# EAGLE schematic Sensor Acquisition Board Rev5 (EAGLE 9.6.2)

## Sheet 1 of 5: Connectors
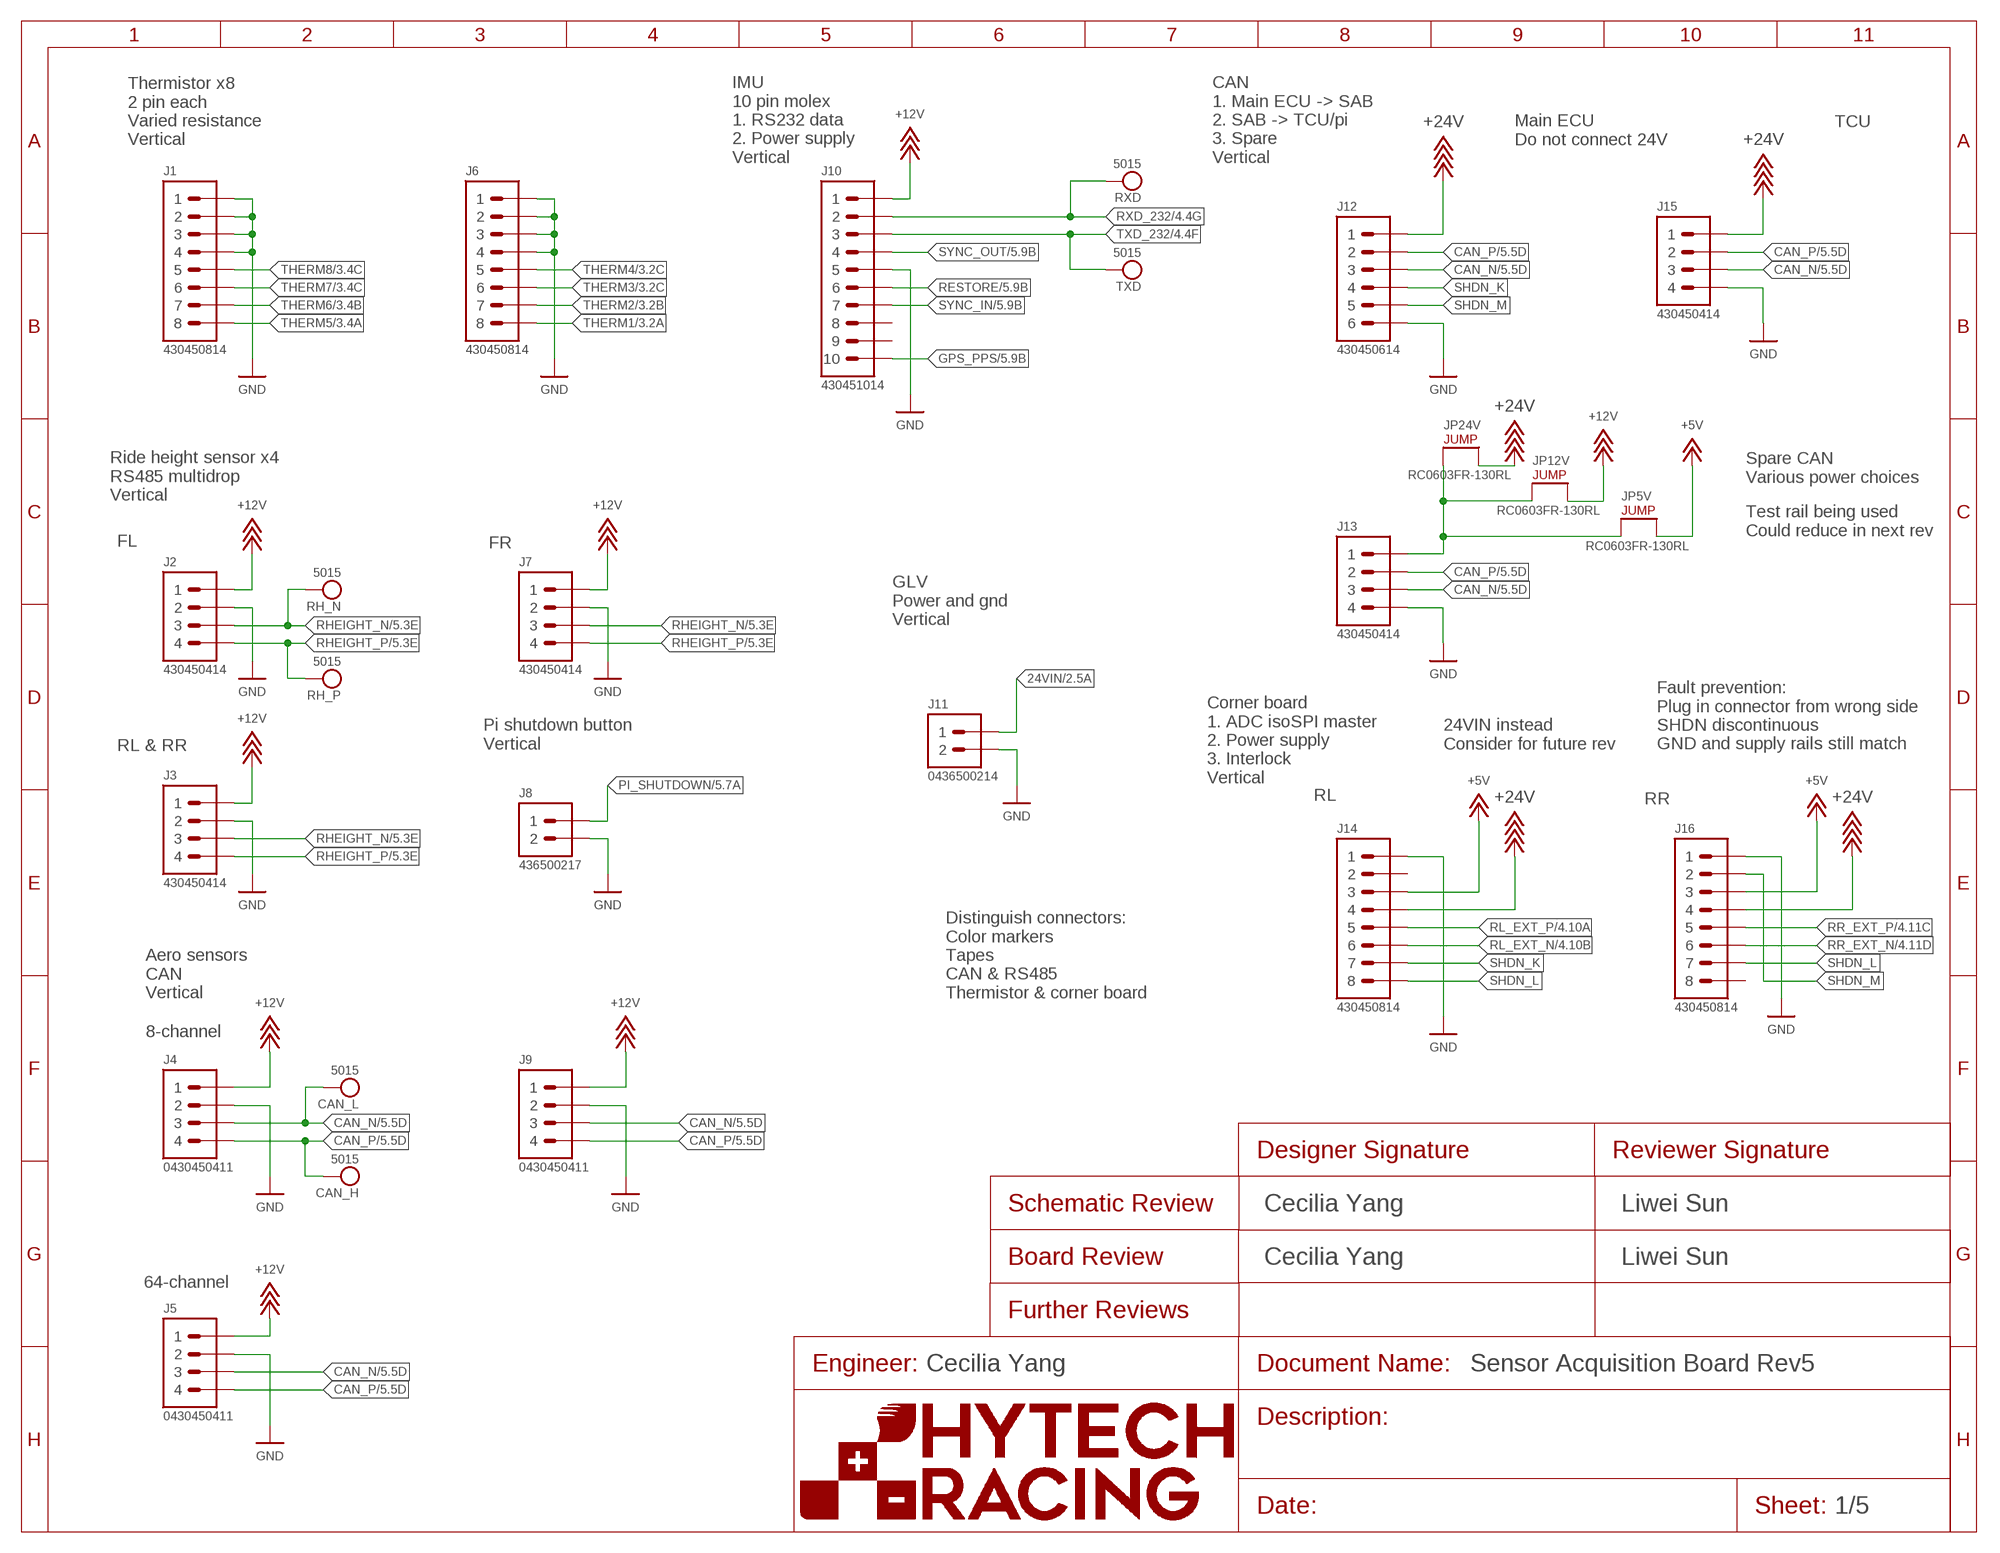
[diagram p0: schematic, sheet 1]

### Parts
CAN_H  TEST_POINT  [5015]
CAN_L  TEST_POINT  [5015]
J1  CONNECTOR-8_μF_T_V_BLACK  [MOLEX_MICROFIT_PTH_VERTICAL_08_DUAL]
J2  CONNECTOR-4_μF_T_V_BLACK  [MOLEX_MICROFIT_PTH_VERTICAL_04_DUAL]
J3  CONNECTOR-4_μF_T_V_BLACK  [MOLEX_MICROFIT_PTH_VERTICAL_04_DUAL]
J4  CONNECTOR-4_μF_S_RA_  [MOLEX_MICROFIT_SMD_RIGHTANGLE_04_DUAL]
J5  CONNECTOR-4_μF_S_RA_  [MOLEX_MICROFIT_SMD_RIGHTANGLE_04_DUAL]
J6  CONNECTOR-8_μF_T_V_BLACK  [MOLEX_MICROFIT_PTH_VERTICAL_08_DUAL]
J7  CONNECTOR-4_μF_T_V_BLACK  [MOLEX_MICROFIT_PTH_VERTICAL_04_DUAL]
J8  CONNECTOR-2_μF_T_V_BLACK  [MOLEX_MICROFIT_PTH_VERTICAL_02_DUAL]
J9  CONNECTOR-4_μF_S_RA_  [MOLEX_MICROFIT_SMD_RIGHTANGLE_04_DUAL]
J10  CONNECTOR-10_MF_T_V_  [MOLEX_MICROFIT_PTH_VERTICAL_10_DUAL]
J11  CONNECTOR-2_MICROFIT_SMD_RIGHTANGLE_02_SINGLE_BLACK  [MOLEX_MICROFIT_SMD_RIGHTANGLE_02_SINGLE]
J12  CONNECTOR-6_μF_T_V_BLACK  [MOLEX_MICROFIT_PTH_VERTICAL_06_DUAL]
J13  CONNECTOR-4_μF_T_V_BLACK  [MOLEX_MICROFIT_PTH_VERTICAL_04_DUAL]
J14  CONNECTOR-8_μF_T_V_BLACK  [MOLEX_MICROFIT_PTH_VERTICAL_08_DUAL]
J15  CONNECTOR-4_μF_T_V_BLACK  [MOLEX_MICROFIT_PTH_VERTICAL_04_DUAL]
J16  CONNECTOR-8_μF_T_V_BLACK  [MOLEX_MICROFIT_PTH_VERTICAL_08_DUAL]
JP5V  JUMPER_0603_  [0603-RES]
JP12V  JUMPER_0603_  [0603-RES]
JP24V  JUMPER_0603_  [0603-RES]
RH_N  TEST_POINT  [5015]
RH_P  TEST_POINT  [5015]
RXD  TEST_POINT  [5015]
TXD  TEST_POINT  [5015]

### Nets
24VIN: J11.1 ; also sheet 2
+5V: J14.3 J16.3 JP5V.2 ; also sheet 2,5
+12V: J2.1 J3.1 J4.1 J5.1 J7.1 J9.1 J10.1 JP12V.2 ; also sheet 2
+24V: J12.1 J14.4 J15.1 J16.4 JP24V.2 ; also sheet 2
CAN_N: CAN_L.1 J4.3 J5.3 J9.3 J12.3 J13.3 J15.3 ; also sheet 5
CAN_P: CAN_H.1 J4.4 J5.4 J9.4 J12.2 J13.2 J15.2 ; also sheet 5
GND: J1.1 J1.2 J1.3 J1.4 J2.2 J3.2 J4.2 J5.2 J6.1 J6.2 J6.3 J6.4 J7.2 J8.2 J9.2 J10.5 J11.2 J12.6 J13.4 J14.1 J15.4 J16.1 ; also sheet 2,3,4,5
GPS_PPS: J10.10 ; also sheet 5
N$5: J13.1 JP5V.1 JP12V.1 JP24V.1
PI_SHUTDOWN: J8.1 ; also sheet 5
RESTORE: J10.6 ; also sheet 5
RHEIGHT_N: J2.3 J3.3 J7.3 RH_N.1 ; also sheet 5
RHEIGHT_P: J2.4 J3.4 J7.4 RH_P.1 ; also sheet 5
RL_EXT_N: J14.6 ; also sheet 4
RL_EXT_P: J14.5 ; also sheet 4
RR_EXT_N: J16.6 ; also sheet 4
RR_EXT_P: J16.5 ; also sheet 4
RXD_232: J10.2 RXD.1 ; also sheet 4
SHDN_K: J12.4 J14.7
SHDN_L: J14.8 J16.7
SHDN_M: J12.5 J16.2
SYNC_IN: J10.7 ; also sheet 5
SYNC_OUT: J10.4 ; also sheet 5
THERM1: J6.8 ; also sheet 3,5
THERM2: J6.7 ; also sheet 3,5
THERM3: J6.6 ; also sheet 3,5
THERM4: J6.5 ; also sheet 3,5
THERM5: J1.8 ; also sheet 3,5
THERM6: J1.7 ; also sheet 3,5
THERM7: J1.6 ; also sheet 3,5
THERM8: J1.5 ; also sheet 3,5
TXD_232: J10.3 TXD.1 ; also sheet 4
Unconnected: J10.8 J10.9 J14.2 J16.8

### Notes on the sheet
- TCU
- Thermistor x8
  2 pin each
  Varied resistance
  Vertical
- Main ECU
  Do not connect 24V
- IMU
  10 pin molex
  1. RS232 data
  2. Power supply
  Vertical
- CAN
  1. Main ECU -> SAB
  2. SAB -> TCU/pi
  3. Spare
  Vertical
- Spare CAN
  Various power choices
- Ride height sensor x4
  RS485 multidrop
  Vertical
- Test rail being used
  Could reduce in next rev
- FL | FR
- GLV
  Power and gnd
  Vertical
- Pi shutdown button
  Vertical
- 24VIN instead
  Consider for future rev
- Fault prevention:
  Plug in connector from wrong side
  SHDN discontinuous
  GND and supply rails still match
- RL & RR
- Corner board
  1. ADC isoSPI master
  2. Power supply
  3. Interlock
  Vertical
- RL | RR
- Aero sensors
  CAN
  Vertical
- Distinguish connectors:
  Color markers
  Tapes
  CAN & RS485
  Thermistor & corner board
- 8-channel
- Cecilia Yang | Liwei Sun
- Cecilia Yang | Liwei Sun
- 64-channel
- Cecilia Yang

## Sheet 2 of 5: Power supplies
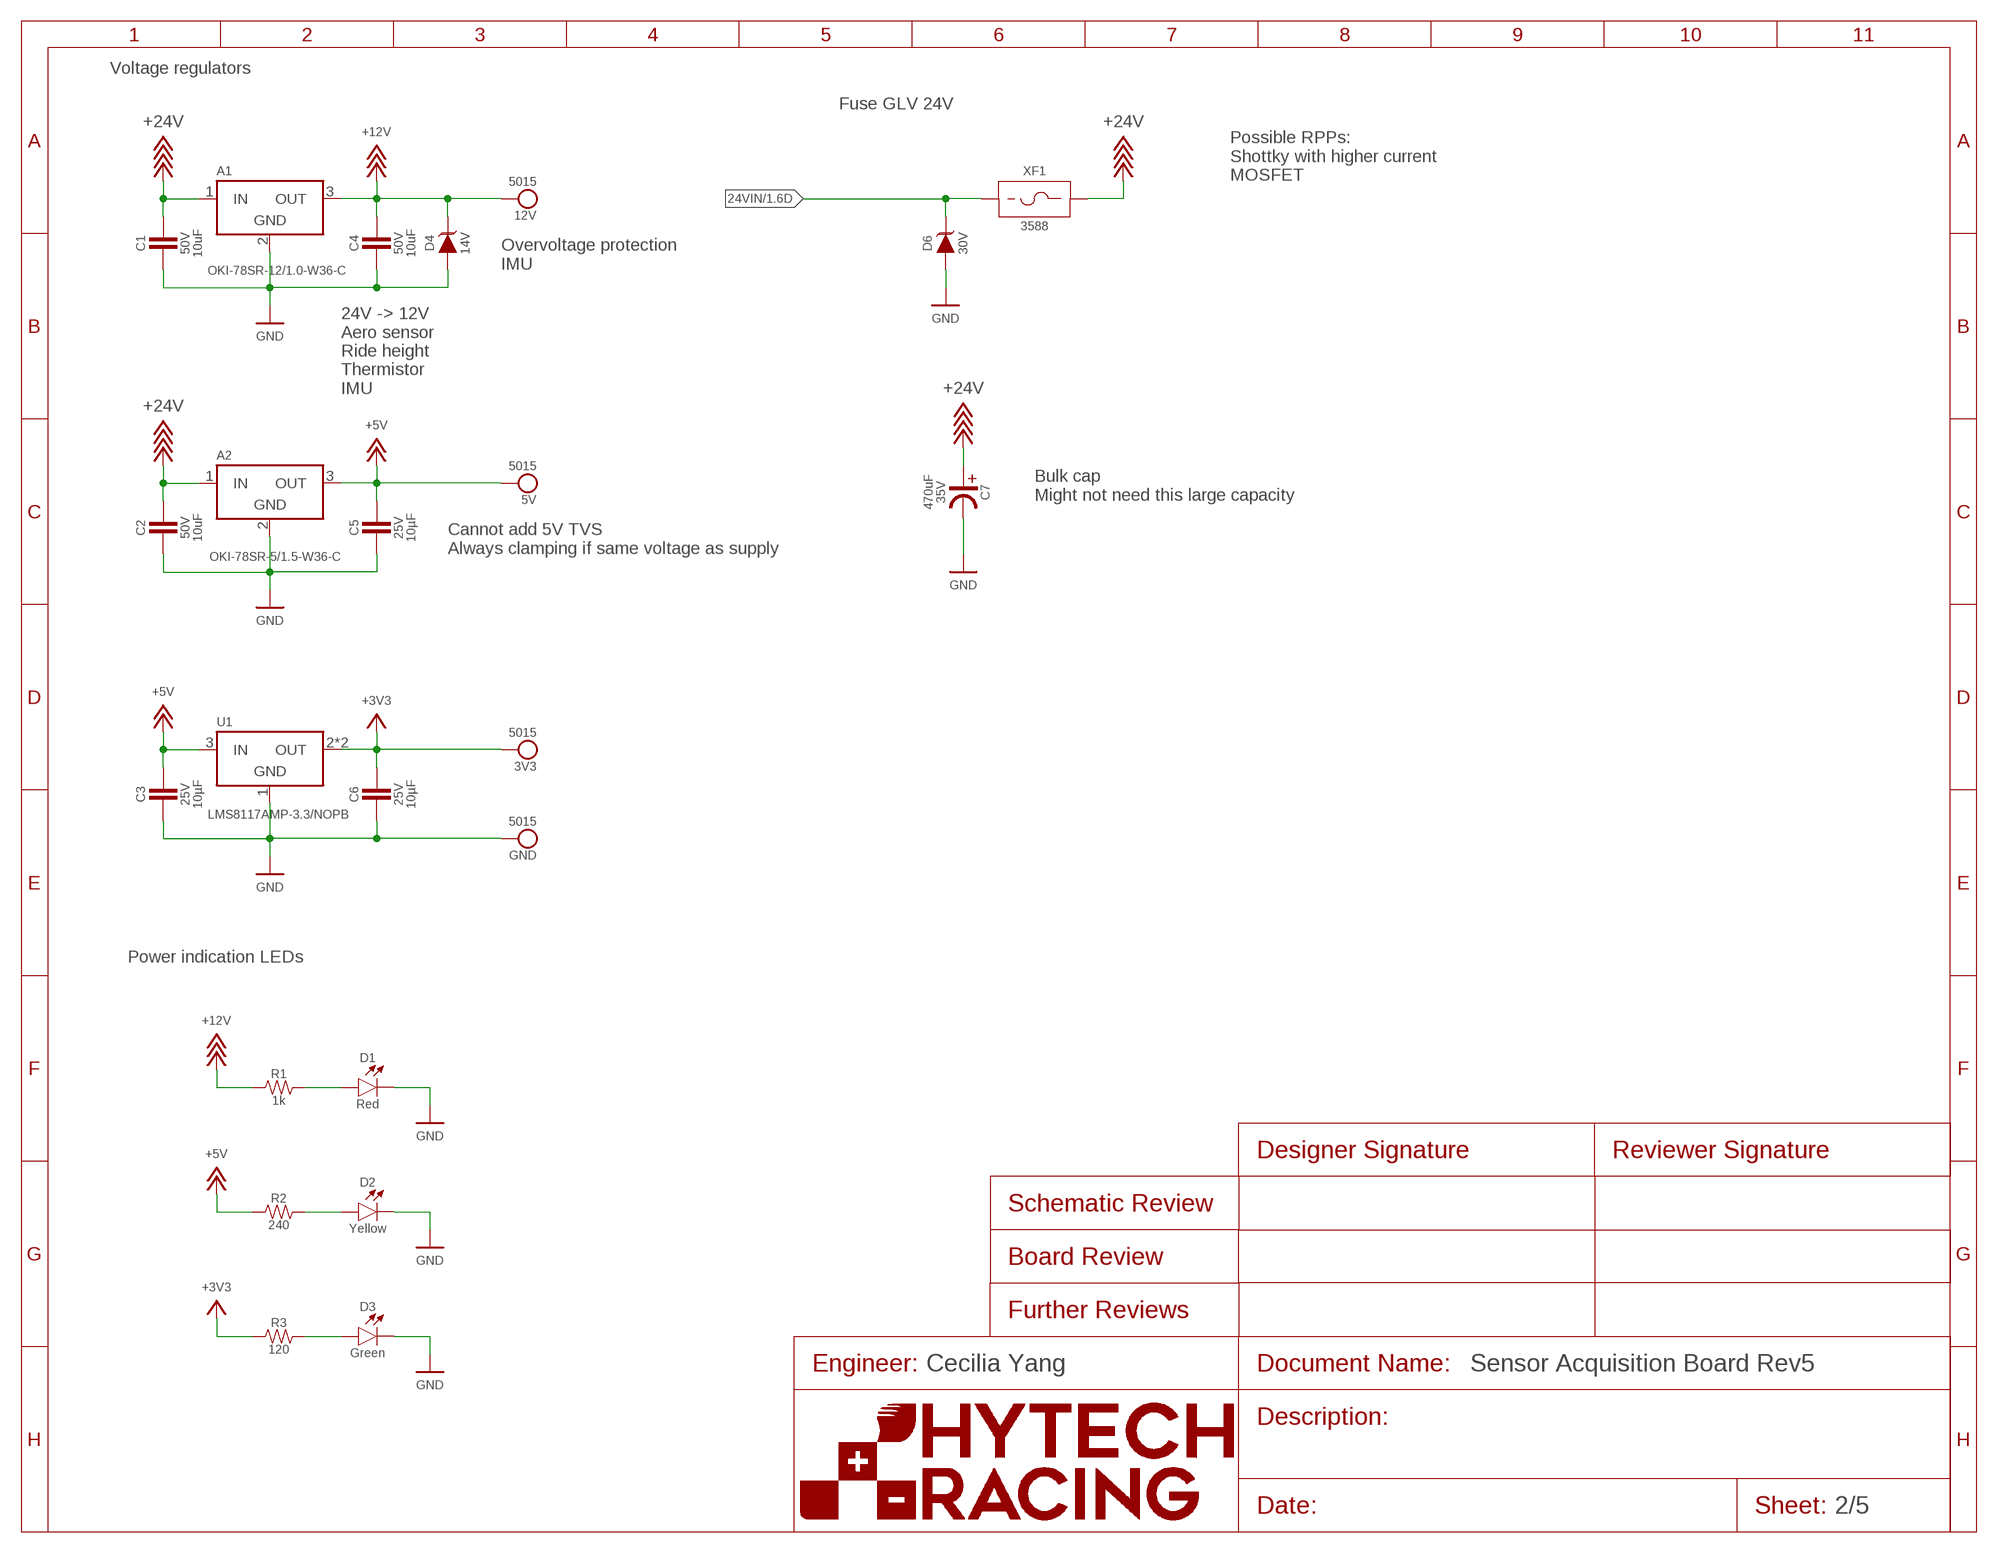
[diagram p1: schematic, sheet 2]

### Parts
3V3  TEST_POINT  [5015]
5V  TEST_POINT  [5015]
12V  TEST_POINT  [5015]
A1  VOLTAGE_REGULATOR_MODULE_OKI-78SR_12V  [OKI-78SR]
A2  VOLTAGE_REGULATOR_MODULE_OKI-78SR_5V  [OKI-78SR]
C1  CAPACITOR_0805_50V_10UF  [0805-CAP]
C2  CAPACITOR_0805_50V_10UF  [0805-CAP]
C3  CAPACITOR_0603_25V_10UF  [0603-CAP]
C4  CAPACITOR_0805_50V_10UF  [0805-CAP]
C5  CAPACITOR_0603_25V_10UF  [0603-CAP]
C6  CAPACITOR_0603_25V_10UF  [0603-CAP]
C7  CAPACITOR_ELECTROLYTIC_EEH_AZS_470UF  [EEH-AZS]
D1  LED_0603_RED  [0603-LED]
D2  LED_0603_YELLOW  [0603-LED]
D3  LED_0603_GREEN  [0603-LED]
D4  TVS_DO-219AB_14V  [SMF]
D6  TVS_DO-214AA_30V  [1.5SMBJ]
GND  TEST_POINT  [5015]
R1  RESISTOR_0603_1K  [0603-RES]
R2  RESISTOR_0603_240  [0603-RES]
R3  RESISTOR_0603_120  [0603-RES]
U1  VOLTAGE_REGULATOR_SOT-223_3.3V  [SOT-223]
XF1  FUSE_HOLDER_MINIBLADESMD  [3588]

### Nets
24VIN: D6.2(C) XF1.1 XF1.2 ; also sheet 1
+3V3: 3V3.1 C6.1 R3.1 U1.2(OUT) U1.4(OUT) ; also sheet 3,4,5
+5V: 5V.1 A2.3(OUT) C3.1 C5.1 R2.1 U1.3(IN) ; also sheet 1,5
+12V: 12V.1 A1.3(OUT) C4.1 D4.P$2(C) R1.1 ; also sheet 1
+24V: A1.1(IN) A2.1(IN) C1.1 C2.1 C7.PLUS XF1.3 XF1.4 ; also sheet 1
GND: A1.2(GND) A2.2(GND) C1.2 C2.2 C3.2 C4.2 C5.2 C6.2 C7.MINUS D1.1(C) D2.1(C) D3.1(C) D4.P$1(A) D6.1(A) GND.1 U1.1(GND) ; also sheet 1,3,4,5
N$23: D1.2(A) R1.2
N$29: D2.2(A) R2.2
N$32: D3.2(A) R3.2

### Notes on the sheet
- Voltage regulators
- Fuse GLV 24V
- Possible RPPs:
  Shottky with higher current
  MOSFET
- Overvoltage protection
  IMU
- 24V -> 12V
  Aero sensor
  Ride height
  Thermistor
  IMU
- Bulk cap
  Might not need this large capacity
- Cannot add 5V TVS
  Always clamping if same voltage as supply
- Power indication LEDs
- Cecilia Yang

## Sheet 3 of 5: Filters
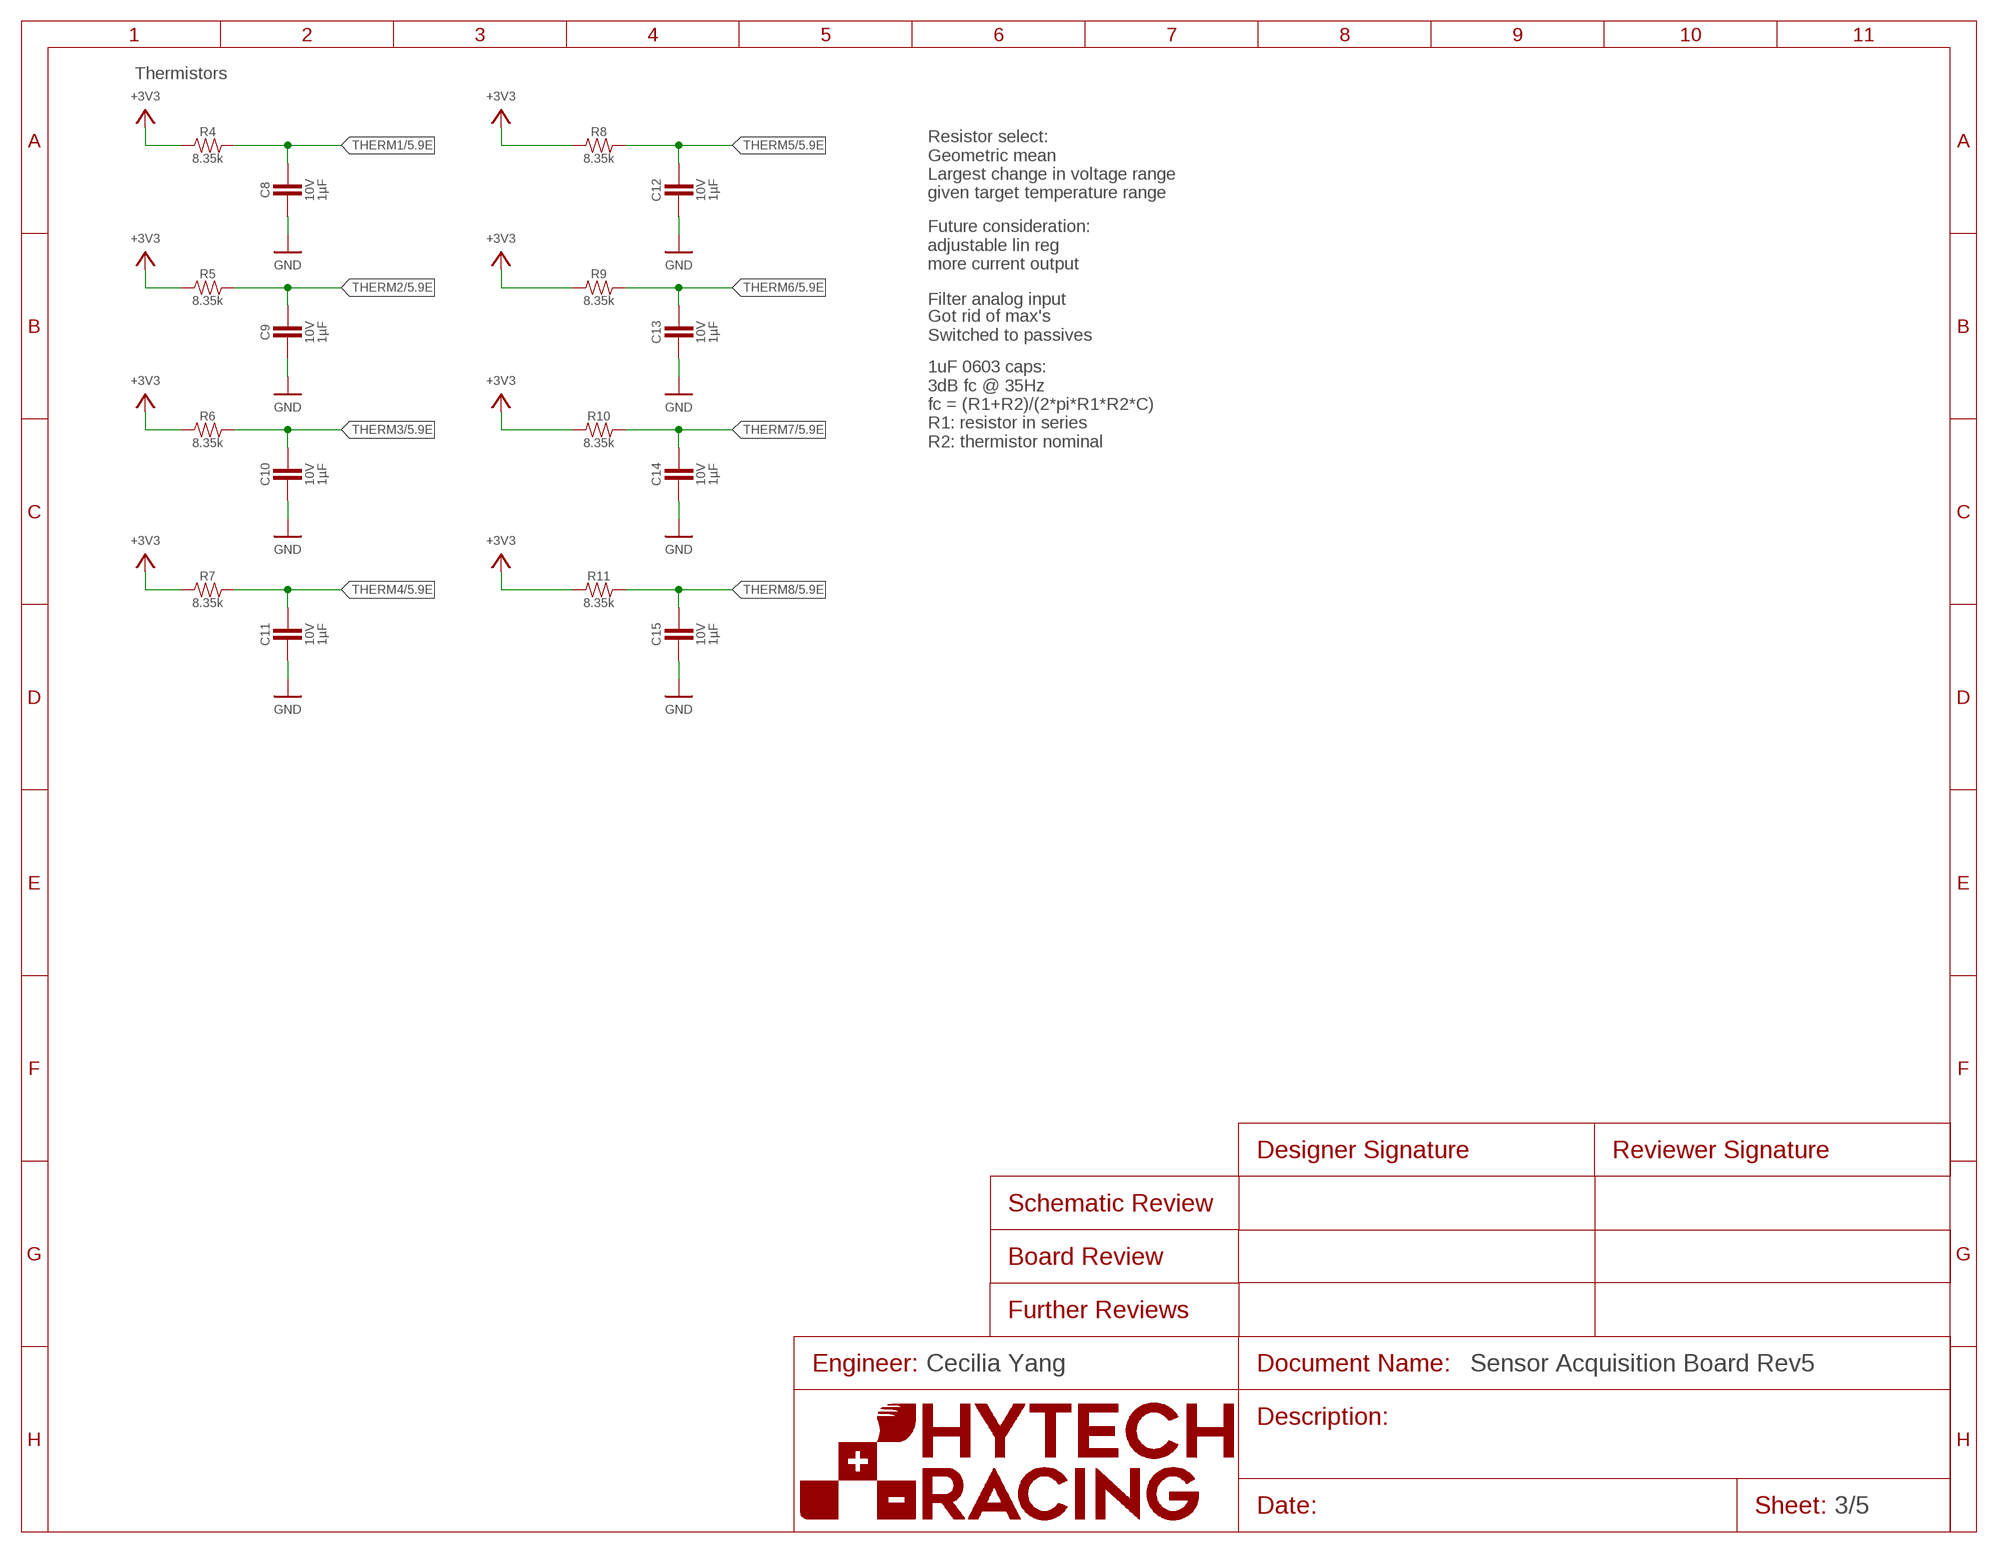
[diagram p2: schematic, sheet 3]

### Parts
C8  CAPACITOR_0603_10V_1UF  [0603-CAP]
C9  CAPACITOR_0603_10V_1UF  [0603-CAP]
C10  CAPACITOR_0603_10V_1UF  [0603-CAP]
C11  CAPACITOR_0603_10V_1UF  [0603-CAP]
C12  CAPACITOR_0603_10V_1UF  [0603-CAP]
C13  CAPACITOR_0603_10V_1UF  [0603-CAP]
C14  CAPACITOR_0603_10V_1UF  [0603-CAP]
C15  CAPACITOR_0603_10V_1UF  [0603-CAP]
R4  RESISTOR_0603_8.35K  [0603-RES]
R5  RESISTOR_0603_8.35K  [0603-RES]
R6  RESISTOR_0603_8.35K  [0603-RES]
R7  RESISTOR_0603_8.35K  [0603-RES]
R8  RESISTOR_0603_8.35K  [0603-RES]
R9  RESISTOR_0603_8.35K  [0603-RES]
R10  RESISTOR_0603_8.35K  [0603-RES]
R11  RESISTOR_0603_8.35K  [0603-RES]

### Nets
+3V3: R4.1 R5.1 R6.1 R7.1 R8.1 R9.1 R10.1 R11.1 ; also sheet 2,4,5
GND: C8.2 C9.2 C10.2 C11.2 C12.2 C13.2 C14.2 C15.2 ; also sheet 1,2,4,5
THERM1: C8.1 R4.2 ; also sheet 1,5
THERM2: C9.1 R5.2 ; also sheet 1,5
THERM3: C10.1 R6.2 ; also sheet 1,5
THERM4: C11.1 R7.2 ; also sheet 1,5
THERM5: C12.1 R8.2 ; also sheet 1,5
THERM6: C13.1 R9.2 ; also sheet 1,5
THERM7: C14.1 R10.2 ; also sheet 1,5
THERM8: C15.1 R11.2 ; also sheet 1,5

### Notes on the sheet
- Thermistors
- Resistor select:
  Geometric mean
  Largest change in voltage range
  given target temperature range
- Future consideration:
  adjustable lin reg
  more current output
- Filter analog input
- Got rid of max's
  Switched to passives
- 1uF 0603 caps:
  3dB fc @ 35Hz
  fc = (R1+R2)/(2*pi*R1*R2*C)
  R1: resistor in series
  R2: thermistor nominal
- Cecilia Yang

## Sheet 4 of 5: isoSPI and RS232
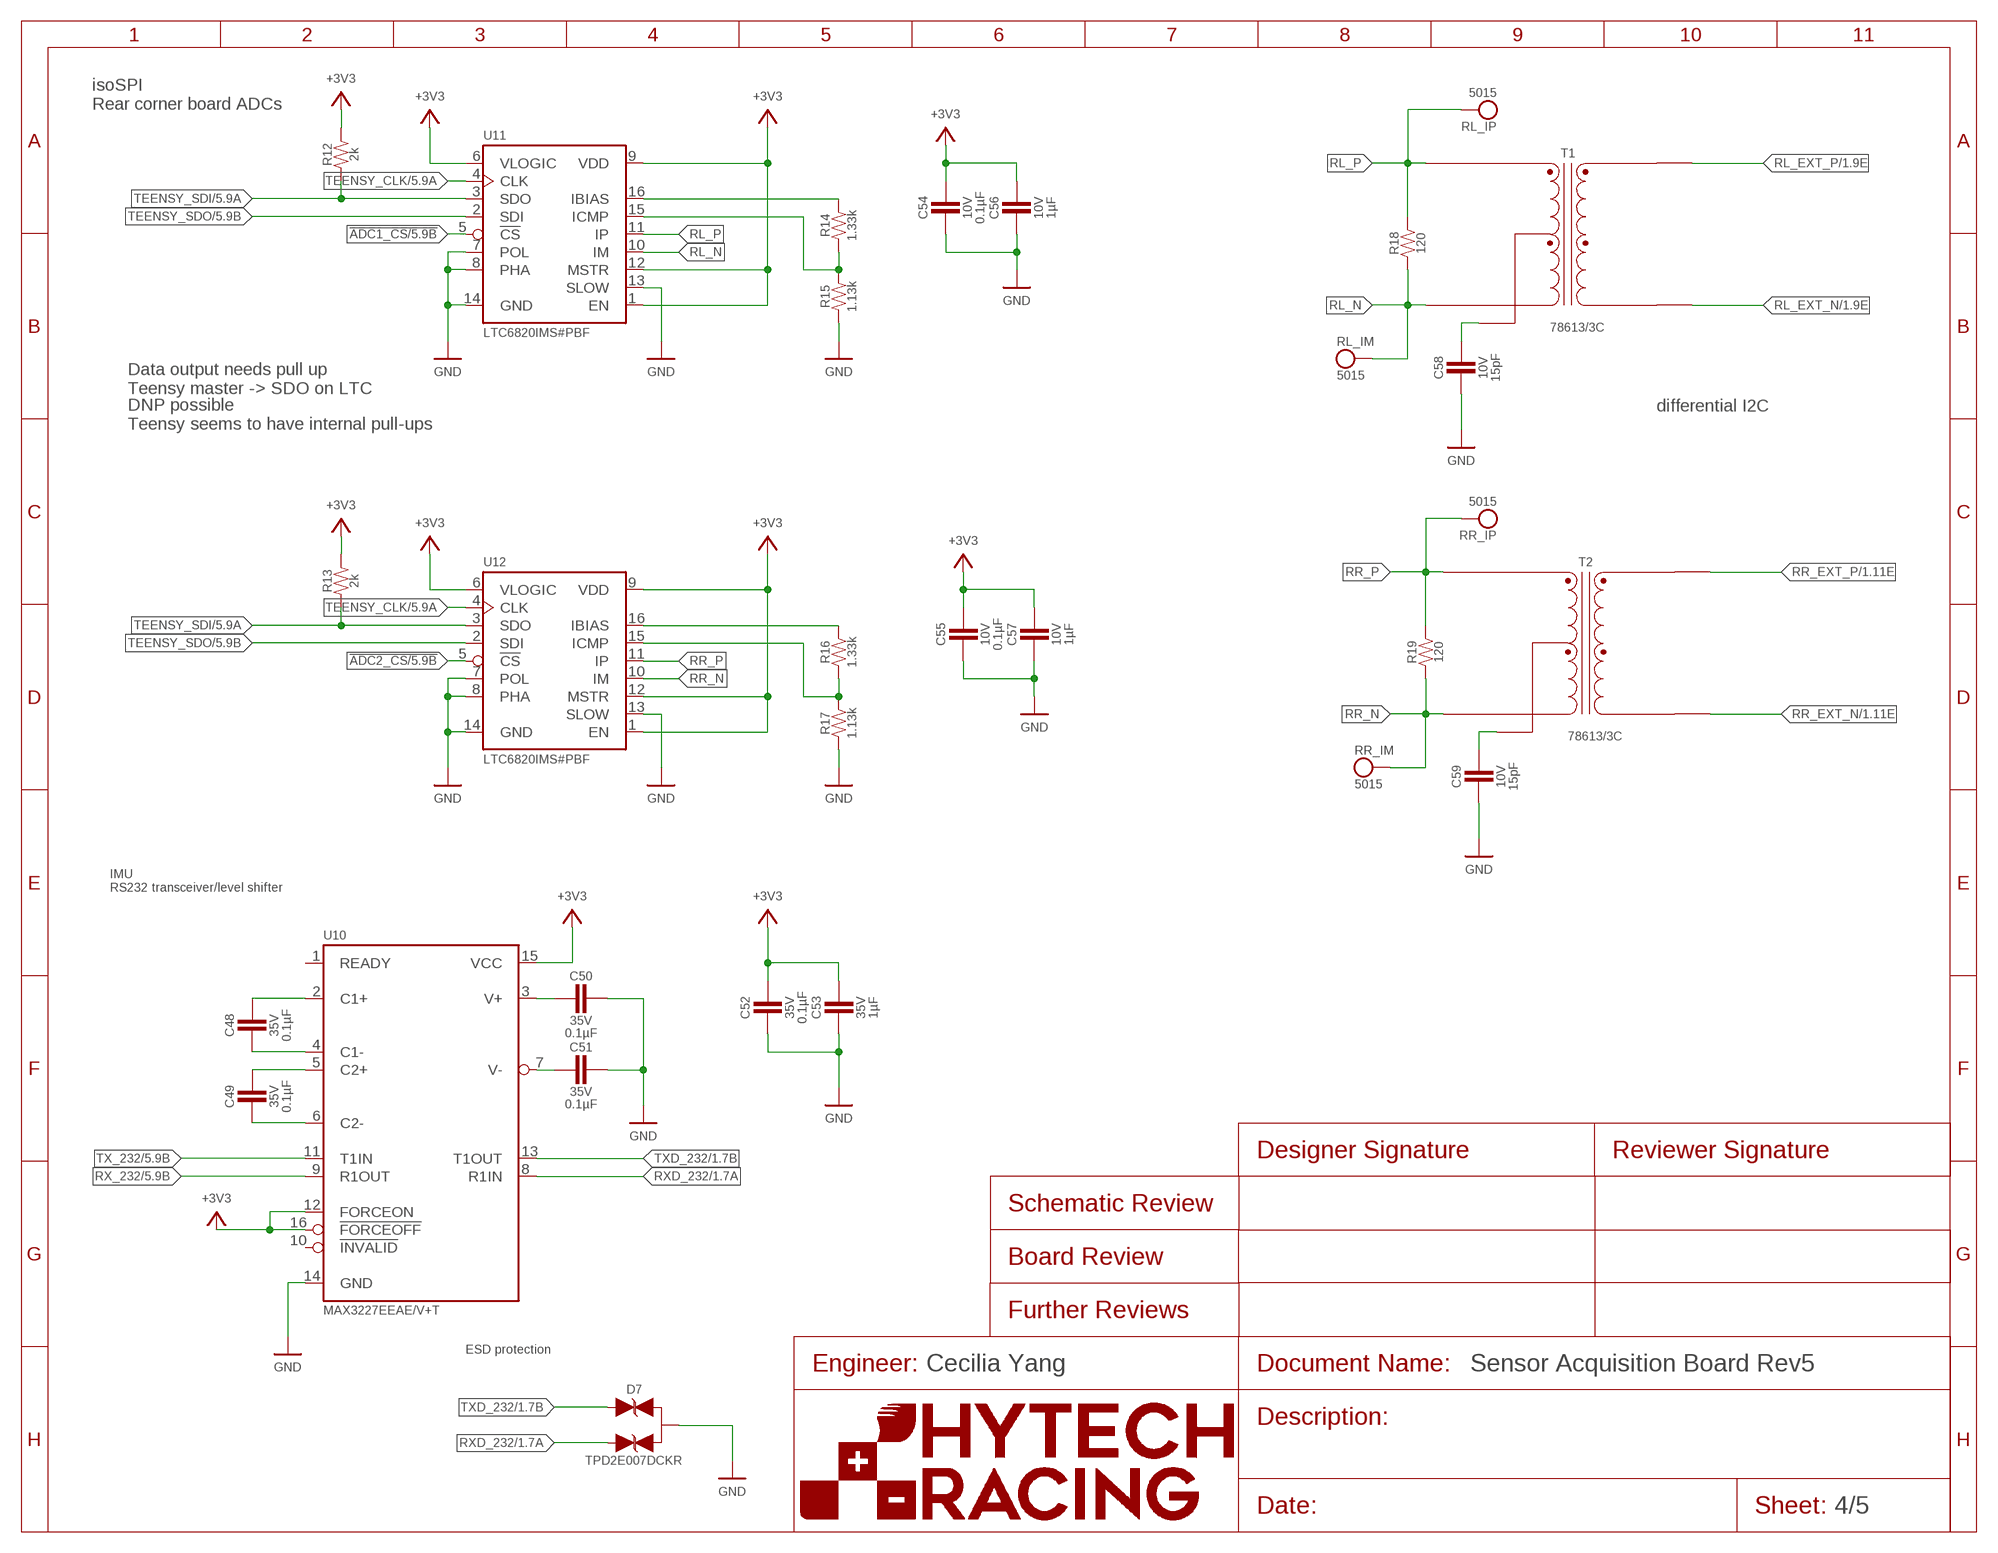
[diagram p3: schematic, sheet 4]

### Parts
C48  CAPACITOR_0603_35V_0.1UF  [0603-CAP]
C49  CAPACITOR_0603_35V_0.1UF  [0603-CAP]
C50  CAPACITOR_0603_35V_0.1UF  [0603-CAP]
C51  CAPACITOR_0603_35V_0.1UF  [0603-CAP]
C52  CAPACITOR_0603_35V_0.1UF  [0603-CAP]
C53  CAPACITOR_0603_35V_1UF  [0603-CAP]
C54  CAPACITOR_0603_10V_0.1UF  [0603-CAP]
C55  CAPACITOR_0603_10V_0.1UF  [0603-CAP]
C56  CAPACITOR_0603_10V_1UF  [0603-CAP]
C57  CAPACITOR_0603_10V_1UF  [0603-CAP]
C58  CAPACITOR_0603_10V_15PF  [0603-CAP]
C59  CAPACITOR_0603_10V_15PF  [0603-CAP]
D7  TVS_BIDIRECTIONAL_DUAL  [SC-70-3]
R12  RESISTOR_0603_2K  [0603-RES]
R13  RESISTOR_0603_2K  [0603-RES]
R14  RESISTOR_0603_1.33K  [0603-RES]
R15  RESISTOR_0603_1.13K  [0603-RES]
R16  RESISTOR_0603_1.33K  [0603-RES]
R17  RESISTOR_0603_1.13K  [0603-RES]
R18  RESISTOR_0603_120  [0603-RES]
R19  RESISTOR_0603_120  [0603-RES]
RL_IM  TEST_POINT  [5015]
RL_IP  TEST_POINT  [5015]
RR_IM  TEST_POINT  [5015]
RR_IP  TEST_POINT  [5015]
T1  78613/3C_78613/3C  [78613/3C]
T2  78613/3C_78613/3C  [78613/3C]
U10  MAX3227  [SSOP-16]
U11  LTC6820  [MSOP-16]
U12  LTC6820  [MSOP-16]

### Nets
!ADC1_CS: U11.5(!CS) ; also sheet 5
!ADC2_CS: U12.5(!CS) ; also sheet 5
+3V3: C52.1 C53.1 C54.1 C55.1 C56.1 C57.1 R12.2 R13.2 U10.12(FORCEON) U10.15(VCC) U10.16(!FORCEOFF) U11.1(EN) U11.6(VLOGIC) U11.9(VDD) U11.12(MSTR) U12.1(EN) U12.6(VLOGIC) U12.9(VDD) U12.12(MSTR) ; also sheet 2,3,5
GND: C50.1 C51.1 C52.2 C53.2 C54.2 C55.2 C56.2 C57.2 C58.2 C59.2 D7.3(A) R15.1 R17.1 U10.14(GND) U11.7(POL) U11.8(PHA) U11.13(SLOW) U11.14(GND) U12.7(POL) U12.8(PHA) U12.13(SLOW) U12.14(GND) ; also sheet 1,2,3,5
N$1: C50.2 U10.3(V+)
N$2: C48.1 U10.2(C1+)
N$3: C51.2 U10.7(V-)
N$16: R16.2 U12.16(IBIAS)
N$17: R16.1 R17.2 U12.15(ICMP)
N$18: R14.2 U11.16(IBIAS)
N$19: R14.1 R15.2 U11.15(ICMP)
N$21: C58.1 T1.2(PRI_CENTER_TAP)
N$22: C59.1 T2.2(PRI_CENTER_TAP)
N$24: C48.2 U10.4(C1-)
N$25: C49.1 U10.5(C2+)
N$26: C49.2 U10.6(C2-)
RL_EXT_N: T1.4(SEC_1) ; also sheet 1
RL_EXT_P: T1.6(SEC_2) ; also sheet 1
RL_N: R18.1 RL_IM.1 T1.3(PRI_2) U11.10(IM)
RL_P: R18.2 RL_IP.1 T1.1(PRI_1) U11.11(IP)
RR_EXT_N: T2.4(SEC_1) ; also sheet 1
RR_EXT_P: T2.6(SEC_2) ; also sheet 1
RR_N: R19.1 RR_IM.1 T2.3(PRI_2) U12.10(IM)
RR_P: R19.2 RR_IP.1 T2.1(PRI_1) U12.11(IP)
RX_232: U10.9(R1OUT) ; also sheet 5
RXD_232: D7.2(C2) U10.8(R1IN) ; also sheet 1
TEENSY_CLK: U11.4(CLK) U12.4(CLK) ; also sheet 5
TEENSY_SDI: R12.1 R13.1 U11.3(SDO) U12.3(SDO) ; also sheet 5
TEENSY_SDO: U11.2(SDI) U12.2(SDI) ; also sheet 5
TX_232: U10.11(T1IN) ; also sheet 5
TXD_232: D7.1(C1) U10.13(T1OUT) ; also sheet 1
Unconnected: U10.1(READY) U10.10(!INVALID)

### Notes on the sheet
- isoSPI
  Rear corner board ADCs
- Data output needs pull up
  Teensy master -> SDO on LTC
- differential I2C
- DNP possible
  Teensy seems to have internal pull-ups
- IMU
  RS232 transceiver/level shifter
- ESD protection
- Cecilia Yang

## Sheet 5 of 5: CAN, RS485, ADC, Teensy 4.0
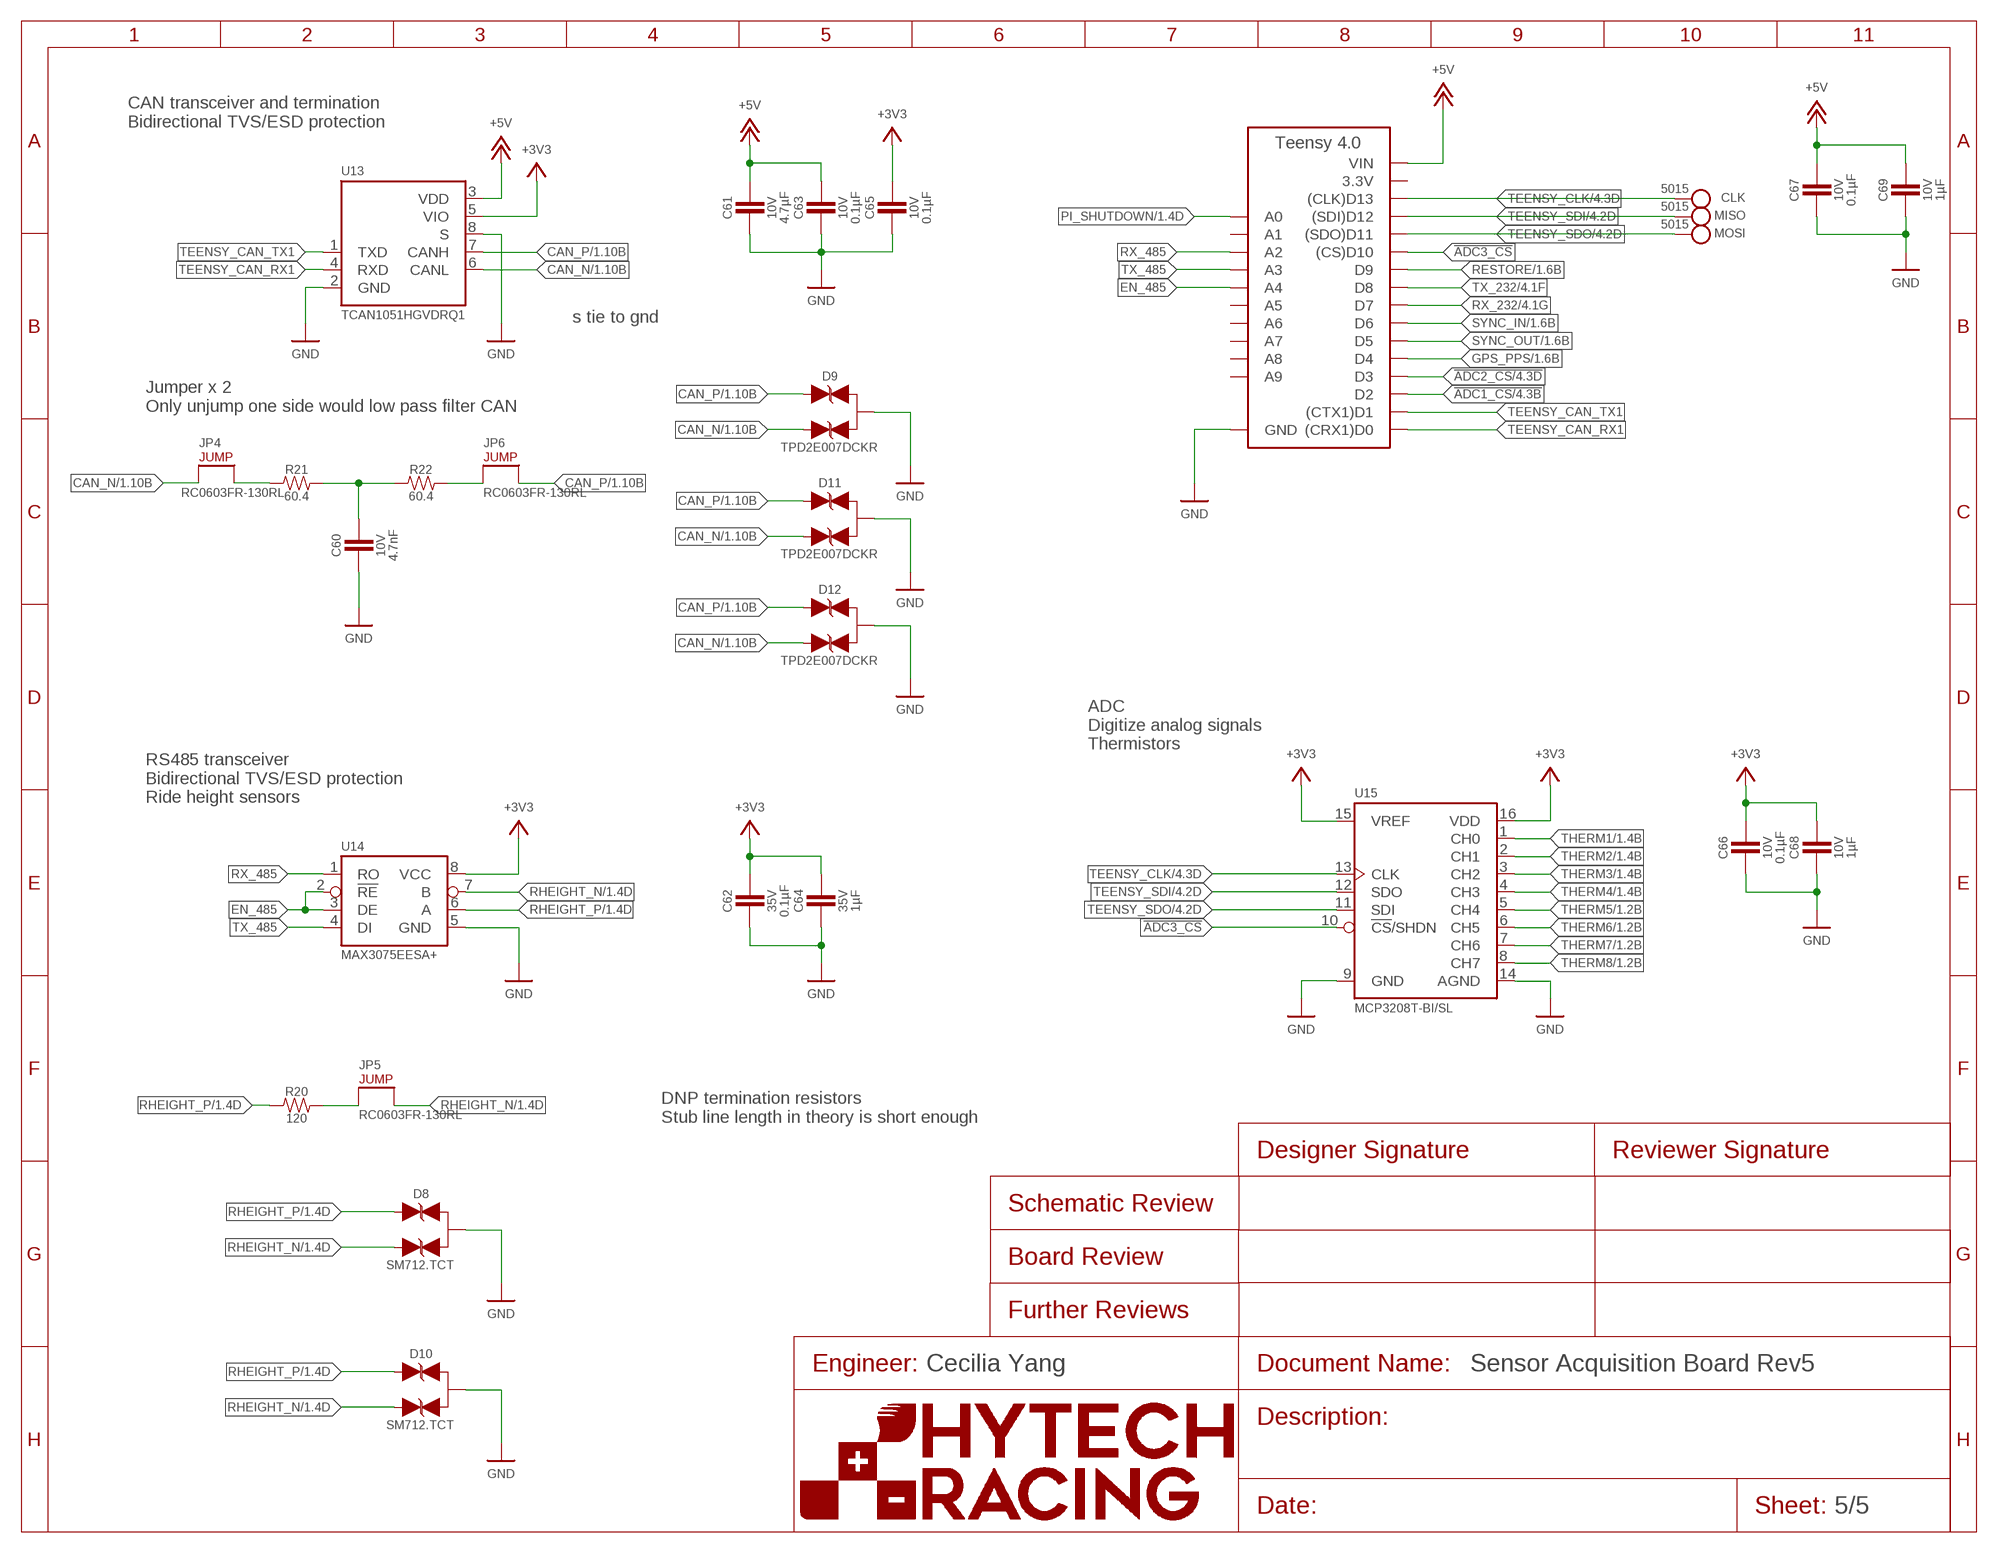
[diagram p4: schematic, sheet 5]

### Parts
A3  TEENSY_4.0SM  [TEENSY_SHORT_SSM]
C60  CAPACITOR_0603_10V_4.7NF  [0603-CAP]
C61  CAPACITOR_0603_10V_4.7UF  [0603-CAP]
C62  CAPACITOR_0603_35V_0.1UF  [0603-CAP]
C63  CAPACITOR_0603_10V_0.1UF  [0603-CAP]
C64  CAPACITOR_0603_35V_1UF  [0603-CAP]
C65  CAPACITOR_0603_10V_0.1UF  [0603-CAP]
C66  CAPACITOR_0603_10V_0.1UF  [0603-CAP]
C67  CAPACITOR_0603_10V_0.1UF  [0603-CAP]
C68  CAPACITOR_0603_10V_1UF  [0603-CAP]
C69  CAPACITOR_0603_10V_1UF  [0603-CAP]
CLK  TEST_POINT  [5015]
D8  TVS_BIDIRECTIONAL_DUALRS422  [SOT-23]
D9  TVS_BIDIRECTIONAL_DUAL  [SC-70-3]
D10  TVS_BIDIRECTIONAL_DUALRS422  [SOT-23]
D11  TVS_BIDIRECTIONAL_DUAL  [SC-70-3]
D12  TVS_BIDIRECTIONAL_DUAL  [SC-70-3]
JP4  JUMPER_0603_  [0603-RES]
JP5  JUMPER_0603_  [0603-RES]
JP6  JUMPER_0603_  [0603-RES]
MISO  TEST_POINT  [5015]
MOSI  TEST_POINT  [5015]
R20  RESISTOR_0603_120  [0603-RES]
R21  RESISTOR_0603_60.4  [0603-RES]
R22  RESISTOR_0603_60.4  [0603-RES]
U13  TCAN1051HQV-Q1  [SOIC-08(NARROW,0.15")]
U14  MAX3075  [SOIC-08(NARROW,0.15")]
U15  MCP3208  [SOIC-16]

### Nets
!ADC1_CS: A3.D2 ; also sheet 4
!ADC2_CS: A3.D3 ; also sheet 4
!ADC3_CS: A3.D10((CS)D10) U15.10(!CS!/SHDN)
+3V3: C62.1 C64.1 C65.1 C66.1 C68.1 U13.5(VIO) U14.8(VCC) U15.15(VREF) U15.16(VDD) ; also sheet 2,3,4
+5V: A3.VIN C61.1 C63.1 C67.1 C69.1 U13.3(VDD) ; also sheet 1,2
CAN_N: D9.2(C2) D11.2(C2) D12.2(C2) JP4.1 U13.6(CANL) ; also sheet 1
CAN_P: D9.1(C1) D11.1(C1) D12.1(C1) JP6.2 U13.7(CANH) ; also sheet 1
EN_485: A3.D18(A4) U14.2(!RE) U14.3(DE)
GND: A3.AGND/GND(GND) A3.GND C60.2 C61.2 C62.2 C63.2 C64.2 C65.2 C66.2 C67.2 C68.2 C69.2 D8.3(A) D9.3(A) D10.3(A) D11.3(A) D12.3(A) U13.2(GND) U13.8(S) U14.5(GND) U15.9(GND) U15.14(AGND) ; also sheet 1,2,3,4
GPS_PPS: A3.D4 ; also sheet 1
N$4: JP5.1 R20.2
N$20: JP4.2 R21.1
N$28: C60.1 R21.2 R22.1
N$30: JP6.1 R22.2
PI_SHUTDOWN: A3.D14(A0) ; also sheet 1
RESTORE: A3.D9 ; also sheet 1
RHEIGHT_N: D8.2(C2) D10.2(C2) JP5.2 U14.7(B) ; also sheet 1
RHEIGHT_P: D8.1(C1) D10.1(C1) R20.1 U14.6(A) ; also sheet 1
RX_232: A3.D7 ; also sheet 4
RX_485: A3.D16(A2) U14.1(RO)
SYNC_IN: A3.D6 ; also sheet 1
SYNC_OUT: A3.D5 ; also sheet 1
TEENSY_CAN_RX1: A3.D0((CRX1)D0) U13.4(RXD)
TEENSY_CAN_TX1: A3.D1((CTX1)D1) U13.1(TXD)
TEENSY_CLK: A3.D13((CLK)D13) CLK.1 U15.13(CLK) ; also sheet 4
TEENSY_SDI: A3.D12((SDI)D12) MISO.1 U15.12(SDO) ; also sheet 4
TEENSY_SDO: A3.D11((SDO)D11) MOSI.1 U15.11(SDI) ; also sheet 4
THERM1: U15.1(CH0) ; also sheet 1,3
THERM2: U15.2(CH1) ; also sheet 1,3
THERM3: U15.3(CH2) ; also sheet 1,3
THERM4: U15.4(CH3) ; also sheet 1,3
THERM5: U15.5(CH4) ; also sheet 1,3
THERM6: U15.6(CH5) ; also sheet 1,3
THERM7: U15.7(CH6) ; also sheet 1,3
THERM8: U15.8(CH7) ; also sheet 1,3
TX_232: A3.D8 ; also sheet 4
TX_485: A3.D17(A3) U14.4(DI)
Unconnected: A3.D15(A1) A3.D19(A5) A3.D20(A6) A3.D21(A7) A3.D22(A8) A3.D23(A9)

### Notes on the sheet
- CAN transceiver and termination
  Bidirectional TVS/ESD protection
- s tie to gnd
- Jumper x 2
  Only unjump one side would low pass filter CAN
- ADC
  Digitize analog signals
  Thermistors
- RS485 transceiver
  Bidirectional TVS/ESD protection
  Ride height sensors
- DNP termination resistors
  Stub line length in theory is short enough
- Cecilia Yang

## Power pins joined to a net without a drawn wire
3.3V: A3.3.3V

## Library data of the parts
3V3 5V 12V CAN_H CAN_L CLK GND MISO MOSI RH_N RH_P RL_IM RL_IP RR_IM RR_IP RXD TXD = HyTechDevices:TEST_POINT: Test Point for Probing; DKPN: 36-5015CT-ND; MANUFACTURER: Keystone Electronics; MOPN: 534-5015; MPN: 5015
A1 = HyTechDevices:VOLTAGE_REGULATOR_MODULE_?_*: Voltage Regulator Modules OKI-78SR Datasheet <https://www.mouser.com/datasheet/2/281/oki-78sr-56393.pdf>; DKPN: 811-3293-ND; MANUFACTURER: Murata Power Solutions Inc.; MOPN: 580-OKI78SR12/1W36C; MPN: OKI-78SR-12/1.0-W36-C
A2 = HyTechDevices:VOLTAGE_REGULATOR_MODULE_?_*: Voltage Regulator Modules OKI-78SR Datasheet <https://www.mouser.com/datasheet/2/281/oki-78sr-56393.pdf>; DKPN: 811-2196-5-ND; MANUFACTURER: Murata Power Solutions Inc.; MOPN: 580-OKI78SR5/1.5W36C; MPN: OKI-78SR-5/1.5-W36-C
A3 = HyTechDevices:TEENSY_4.0: Teensy 4.0 Datasheet <https://www.pjrc.com/store/teensy40.html> Requires ordering of: 2: 14 pin, 0.1" pitch female headers. Recommend Samtec SSM-114-L-SV for surface mount variant.; TEENSY: 4.0
C1 C2 C4 = HyTechDevices:CAPACITOR_?_*: Capacitor, Non-Polarized VJ...1BC Series Datasheet <https://www.mouser.com/datasheet/2/427/vjw1bcbascomseries-1762447.pdf> Samsung Datasheet <https://www.mouser.com/datasheet/2/585/MLCC-1837944.pdf> Samsung Automotive MLCC Datasheet <https://www.mouser.com/datasheet/2/585/MLCC_Automotive-1837966.pdf> Walsin Datasheet <https://www.mouser.com/datasheet/2/210/WTC_MLCC_General_Purpose-1534899.pdf> GRM188R61A226ME15D <https://www.mouser.com/datasheet/2/281/1/GRM188R61A226ME15_02A-1985787.pdf> GRM188R61E106MA73D <https://www.mouser.com/datasheet/2/281/1/GRM188R61E106MA73_01A-1985806.pdf> 885012006013 <https://www.mouser.com/datasheet/2/445/885012006013-1726946.pdf> 2220Y6300105KXTWS2 <https://www.mouser.com/datasheet/2/218/SMD_High_and_Std_StackiCap_P62-1825512.pdf> Yageo Class 2, X5R <https://www.mouser.com/datasheet/2/447/UPY_GPHC_X5R_4V_to_50V_26-1827097.pdf> TDK C Series <https://www.mouser.com/ProductDetail/TDK/C3216X5R1V226M160AC?qs=%2Fha2pyFadujbcx9jh7lYl%2F4NeMoXFhdc8AqVWNq4wW6M2y7zl6GzBuhgtI0ngznN> AVX Automotive MLCC <https://www.mouser.com/datasheet/2/40/AutoMLCC-777028.pdf> KEMET X7R Series <https://www.mouser.com/datasheet/2/212/KEM_C1002_X7R_SMD-1102033.pdf> Kyocera AVX <https://www.mouser.com/datasheet/2/40/C0GNP0_Dielectric-951274.pdf> GRM21BR61H <https://www.mouser.com/datasheet/2/281/1/GRM21BR61H106KE43_01A-1986884.pdf> C1812W104KDRACTU <https://www.mouser.com/datasheet/2/212/KEM_C1034_X7R_HV_ARC_SMD-1101730.pdf> CGA series - MLCC Automotive grade <https://product.tdk.com/system/files/dam/doc/product/capacitor/ceramic/mlcc/catalog/mlcc_automotive_general_en.pdf> TDK C Series Data Sheet <https://product.tdk.com/system/files/dam/doc/product/capacitor/ceramic/mlcc/catalog/mlcc_commercial_general_en.pdf> Kemet Datasheet <https://connect.kemet.com:7667/gateway/IntelliData-ComponentDocumentation/1.0/download/datasheet/C0603C220K3RACAUTO>; CAPACITANCE: 10uF; DKPN: 490-18663-2-ND; MANUFACTURER: Murata; MOPN: 81-GRM21BR61H106KE3L; MPN: GRM21BR61H106KE43L; TOLERANCE: 10%; VOLTAGE: 50V
C3 C5 C6 = HyTechDevices:CAPACITOR_?_*: Capacitor, Non-Polarized VJ...1BC Series Datasheet <https://www.mouser.com/datasheet/2/427/vjw1bcbascomseries-1762447.pdf> Samsung Datasheet <https://www.mouser.com/datasheet/2/585/MLCC-1837944.pdf> Samsung Automotive MLCC Datasheet <https://www.mouser.com/datasheet/2/585/MLCC_Automotive-1837966.pdf> Walsin Datasheet <https://www.mouser.com/datasheet/2/210/WTC_MLCC_General_Purpose-1534899.pdf> GRM188R61A226ME15D <https://www.mouser.com/datasheet/2/281/1/GRM188R61A226ME15_02A-1985787.pdf> GRM188R61E106MA73D <https://www.mouser.com/datasheet/2/281/1/GRM188R61E106MA73_01A-1985806.pdf> 885012006013 <https://www.mouser.com/datasheet/2/445/885012006013-1726946.pdf> 2220Y6300105KXTWS2 <https://www.mouser.com/datasheet/2/218/SMD_High_and_Std_StackiCap_P62-1825512.pdf> Yageo Class 2, X5R <https://www.mouser.com/datasheet/2/447/UPY_GPHC_X5R_4V_to_50V_26-1827097.pdf> TDK C Series <https://www.mouser.com/ProductDetail/TDK/C3216X5R1V226M160AC?qs=%2Fha2pyFadujbcx9jh7lYl%2F4NeMoXFhdc8AqVWNq4wW6M2y7zl6GzBuhgtI0ngznN> AVX Automotive MLCC <https://www.mouser.com/datasheet/2/40/AutoMLCC-777028.pdf> KEMET X7R Series <https://www.mouser.com/datasheet/2/212/KEM_C1002_X7R_SMD-1102033.pdf> Kyocera AVX <https://www.mouser.com/datasheet/2/40/C0GNP0_Dielectric-951274.pdf> GRM21BR61H <https://www.mouser.com/datasheet/2/281/1/GRM21BR61H106KE43_01A-1986884.pdf> C1812W104KDRACTU <https://www.mouser.com/datasheet/2/212/KEM_C1034_X7R_HV_ARC_SMD-1101730.pdf> CGA series - MLCC Automotive grade <https://product.tdk.com/system/files/dam/doc/product/capacitor/ceramic/mlcc/catalog/mlcc_automotive_general_en.pdf> TDK C Series Data Sheet <https://product.tdk.com/system/files/dam/doc/product/capacitor/ceramic/mlcc/catalog/mlcc_commercial_general_en.pdf> Kemet Datasheet <https://connect.kemet.com:7667/gateway/IntelliData-ComponentDocumentation/1.0/download/datasheet/C0603C220K3RACAUTO>; CAPACITANCE: 10µF; DKPN: 490-7202-1-ND; MANUFACTURER: Murata Electronics; MOPN: 81-GRM188R61E106MA3D; MPN: GRM188R61E106MA73D; TOLERANCE: 20%; VOLTAGE: 25V
C7 = HyTechDevices:CAPACITOR_ELECTROLYTIC_?_*: A759 Series Aluminium Hybrid Electrolytic Capacitor Datasheet <https://www.mouser.com/datasheet/2/212/KEM_A4072_A759-1104329.pdf> EEH_AZS Hybrid Electrolytic Capacitor Datasheet <https://www.mouser.com/datasheet/2/315/DMD0000COL92-1141863.pdf> EEU-FP1E Aluminum Electrolytic Capacitor Datasheet <https://www.mouser.com/datasheet/2/315/RDF0000C1260-1391675.pdf>; CAPACITANCE: 470uF; DKPN: 10-EEH-AZS1V471BCT-ND; MANUFACTURER: Panasonic Electronic Components; MOPN: 667-EEH-AZS1V471B; MPN: EEH-AZS1V471B; TOLERANCE: 20&; VOLTAGE: 35V
C8-C15 C56 C57 C68 C69 = HyTechDevices:CAPACITOR_?_*: Capacitor, Non-Polarized VJ...1BC Series Datasheet <https://www.mouser.com/datasheet/2/427/vjw1bcbascomseries-1762447.pdf> Samsung Datasheet <https://www.mouser.com/datasheet/2/585/MLCC-1837944.pdf> Samsung Automotive MLCC Datasheet <https://www.mouser.com/datasheet/2/585/MLCC_Automotive-1837966.pdf> Walsin Datasheet <https://www.mouser.com/datasheet/2/210/WTC_MLCC_General_Purpose-1534899.pdf> GRM188R61A226ME15D <https://www.mouser.com/datasheet/2/281/1/GRM188R61A226ME15_02A-1985787.pdf> GRM188R61E106MA73D <https://www.mouser.com/datasheet/2/281/1/GRM188R61E106MA73_01A-1985806.pdf> 885012006013 <https://www.mouser.com/datasheet/2/445/885012006013-1726946.pdf> 2220Y6300105KXTWS2 <https://www.mouser.com/datasheet/2/218/SMD_High_and_Std_StackiCap_P62-1825512.pdf> Yageo Class 2, X5R <https://www.mouser.com/datasheet/2/447/UPY_GPHC_X5R_4V_to_50V_26-1827097.pdf> TDK C Series <https://www.mouser.com/ProductDetail/TDK/C3216X5R1V226M160AC?qs=%2Fha2pyFadujbcx9jh7lYl%2F4NeMoXFhdc8AqVWNq4wW6M2y7zl6GzBuhgtI0ngznN> AVX Automotive MLCC <https://www.mouser.com/datasheet/2/40/AutoMLCC-777028.pdf> KEMET X7R Series <https://www.mouser.com/datasheet/2/212/KEM_C1002_X7R_SMD-1102033.pdf> Kyocera AVX <https://www.mouser.com/datasheet/2/40/C0GNP0_Dielectric-951274.pdf> GRM21BR61H <https://www.mouser.com/datasheet/2/281/1/GRM21BR61H106KE43_01A-1986884.pdf> C1812W104KDRACTU <https://www.mouser.com/datasheet/2/212/KEM_C1034_X7R_HV_ARC_SMD-1101730.pdf> CGA series - MLCC Automotive grade <https://product.tdk.com/system/files/dam/doc/product/capacitor/ceramic/mlcc/catalog/mlcc_automotive_general_en.pdf> TDK C Series Data Sheet <https://product.tdk.com/system/files/dam/doc/product/capacitor/ceramic/mlcc/catalog/mlcc_commercial_general_en.pdf> Kemet Datasheet <https://connect.kemet.com:7667/gateway/IntelliData-ComponentDocumentation/1.0/download/datasheet/C0603C220K3RACAUTO>; CAPACITANCE: 1µF; DKPN: 311-1796-1-ND; MANUFACTURER: Yageo; MOPN: 603-CC603KRX7R6BB105; MPN: CC0603KRX7R6BB105; TOLERANCE: 10%; VOLTAGE: 10V
C48-C52 C62 = HyTechDevices:CAPACITOR_?_*: Capacitor, Non-Polarized VJ...1BC Series Datasheet <https://www.mouser.com/datasheet/2/427/vjw1bcbascomseries-1762447.pdf> Samsung Datasheet <https://www.mouser.com/datasheet/2/585/MLCC-1837944.pdf> Samsung Automotive MLCC Datasheet <https://www.mouser.com/datasheet/2/585/MLCC_Automotive-1837966.pdf> Walsin Datasheet <https://www.mouser.com/datasheet/2/210/WTC_MLCC_General_Purpose-1534899.pdf> GRM188R61A226ME15D <https://www.mouser.com/datasheet/2/281/1/GRM188R61A226ME15_02A-1985787.pdf> GRM188R61E106MA73D <https://www.mouser.com/datasheet/2/281/1/GRM188R61E106MA73_01A-1985806.pdf> 885012006013 <https://www.mouser.com/datasheet/2/445/885012006013-1726946.pdf> 2220Y6300105KXTWS2 <https://www.mouser.com/datasheet/2/218/SMD_High_and_Std_StackiCap_P62-1825512.pdf> Yageo Class 2, X5R <https://www.mouser.com/datasheet/2/447/UPY_GPHC_X5R_4V_to_50V_26-1827097.pdf> TDK C Series <https://www.mouser.com/ProductDetail/TDK/C3216X5R1V226M160AC?qs=%2Fha2pyFadujbcx9jh7lYl%2F4NeMoXFhdc8AqVWNq4wW6M2y7zl6GzBuhgtI0ngznN> AVX Automotive MLCC <https://www.mouser.com/datasheet/2/40/AutoMLCC-777028.pdf> KEMET X7R Series <https://www.mouser.com/datasheet/2/212/KEM_C1002_X7R_SMD-1102033.pdf> Kyocera AVX <https://www.mouser.com/datasheet/2/40/C0GNP0_Dielectric-951274.pdf> GRM21BR61H <https://www.mouser.com/datasheet/2/281/1/GRM21BR61H106KE43_01A-1986884.pdf> C1812W104KDRACTU <https://www.mouser.com/datasheet/2/212/KEM_C1034_X7R_HV_ARC_SMD-1101730.pdf> CGA series - MLCC Automotive grade <https://product.tdk.com/system/files/dam/doc/product/capacitor/ceramic/mlcc/catalog/mlcc_automotive_general_en.pdf> TDK C Series Data Sheet <https://product.tdk.com/system/files/dam/doc/product/capacitor/ceramic/mlcc/catalog/mlcc_commercial_general_en.pdf> Kemet Datasheet <https://connect.kemet.com:7667/gateway/IntelliData-ComponentDocumentation/1.0/download/datasheet/C0603C220K3RACAUTO>; CAPACITANCE: 0.1µF; DKPN: 587-3354-1-ND; MANUFACTURER: Taiyo Yuden; MOPN: 963-GMK107B7104KAHT; MPN: GMK107B7104KAHT; TOLERANCE: 10%; VOLTAGE: 35V
C53 C64 = HyTechDevices:CAPACITOR_?_*: Capacitor, Non-Polarized VJ...1BC Series Datasheet <https://www.mouser.com/datasheet/2/427/vjw1bcbascomseries-1762447.pdf> Samsung Datasheet <https://www.mouser.com/datasheet/2/585/MLCC-1837944.pdf> Samsung Automotive MLCC Datasheet <https://www.mouser.com/datasheet/2/585/MLCC_Automotive-1837966.pdf> Walsin Datasheet <https://www.mouser.com/datasheet/2/210/WTC_MLCC_General_Purpose-1534899.pdf> GRM188R61A226ME15D <https://www.mouser.com/datasheet/2/281/1/GRM188R61A226ME15_02A-1985787.pdf> GRM188R61E106MA73D <https://www.mouser.com/datasheet/2/281/1/GRM188R61E106MA73_01A-1985806.pdf> 885012006013 <https://www.mouser.com/datasheet/2/445/885012006013-1726946.pdf> 2220Y6300105KXTWS2 <https://www.mouser.com/datasheet/2/218/SMD_High_and_Std_StackiCap_P62-1825512.pdf> Yageo Class 2, X5R <https://www.mouser.com/datasheet/2/447/UPY_GPHC_X5R_4V_to_50V_26-1827097.pdf> TDK C Series <https://www.mouser.com/ProductDetail/TDK/C3216X5R1V226M160AC?qs=%2Fha2pyFadujbcx9jh7lYl%2F4NeMoXFhdc8AqVWNq4wW6M2y7zl6GzBuhgtI0ngznN> AVX Automotive MLCC <https://www.mouser.com/datasheet/2/40/AutoMLCC-777028.pdf> KEMET X7R Series <https://www.mouser.com/datasheet/2/212/KEM_C1002_X7R_SMD-1102033.pdf> Kyocera AVX <https://www.mouser.com/datasheet/2/40/C0GNP0_Dielectric-951274.pdf> GRM21BR61H <https://www.mouser.com/datasheet/2/281/1/GRM21BR61H106KE43_01A-1986884.pdf> C1812W104KDRACTU <https://www.mouser.com/datasheet/2/212/KEM_C1034_X7R_HV_ARC_SMD-1101730.pdf> CGA series - MLCC Automotive grade <https://product.tdk.com/system/files/dam/doc/product/capacitor/ceramic/mlcc/catalog/mlcc_automotive_general_en.pdf> TDK C Series Data Sheet <https://product.tdk.com/system/files/dam/doc/product/capacitor/ceramic/mlcc/catalog/mlcc_commercial_general_en.pdf> Kemet Datasheet <https://connect.kemet.com:7667/gateway/IntelliData-ComponentDocumentation/1.0/download/datasheet/C0603C220K3RACAUTO>; CAPACITANCE: 1µF; DKPN: 445-173625-1-ND; MANUFACTURER: TDK Corporation; MOPN: 810-C1608X7R1V105KAE; MPN: C1608X7R1V105K080AE; TOLERANCE: 10%; VOLTAGE: 35V
C54 C55 C63 C65-C67 = HyTechDevices:CAPACITOR_?_*: Capacitor, Non-Polarized VJ...1BC Series Datasheet <https://www.mouser.com/datasheet/2/427/vjw1bcbascomseries-1762447.pdf> Samsung Datasheet <https://www.mouser.com/datasheet/2/585/MLCC-1837944.pdf> Samsung Automotive MLCC Datasheet <https://www.mouser.com/datasheet/2/585/MLCC_Automotive-1837966.pdf> Walsin Datasheet <https://www.mouser.com/datasheet/2/210/WTC_MLCC_General_Purpose-1534899.pdf> GRM188R61A226ME15D <https://www.mouser.com/datasheet/2/281/1/GRM188R61A226ME15_02A-1985787.pdf> GRM188R61E106MA73D <https://www.mouser.com/datasheet/2/281/1/GRM188R61E106MA73_01A-1985806.pdf> 885012006013 <https://www.mouser.com/datasheet/2/445/885012006013-1726946.pdf> 2220Y6300105KXTWS2 <https://www.mouser.com/datasheet/2/218/SMD_High_and_Std_StackiCap_P62-1825512.pdf> Yageo Class 2, X5R <https://www.mouser.com/datasheet/2/447/UPY_GPHC_X5R_4V_to_50V_26-1827097.pdf> TDK C Series <https://www.mouser.com/ProductDetail/TDK/C3216X5R1V226M160AC?qs=%2Fha2pyFadujbcx9jh7lYl%2F4NeMoXFhdc8AqVWNq4wW6M2y7zl6GzBuhgtI0ngznN> AVX Automotive MLCC <https://www.mouser.com/datasheet/2/40/AutoMLCC-777028.pdf> KEMET X7R Series <https://www.mouser.com/datasheet/2/212/KEM_C1002_X7R_SMD-1102033.pdf> Kyocera AVX <https://www.mouser.com/datasheet/2/40/C0GNP0_Dielectric-951274.pdf> GRM21BR61H <https://www.mouser.com/datasheet/2/281/1/GRM21BR61H106KE43_01A-1986884.pdf> C1812W104KDRACTU <https://www.mouser.com/datasheet/2/212/KEM_C1034_X7R_HV_ARC_SMD-1101730.pdf> CGA series - MLCC Automotive grade <https://product.tdk.com/system/files/dam/doc/product/capacitor/ceramic/mlcc/catalog/mlcc_automotive_general_en.pdf> TDK C Series Data Sheet <https://product.tdk.com/system/files/dam/doc/product/capacitor/ceramic/mlcc/catalog/mlcc_commercial_general_en.pdf> Kemet Datasheet <https://connect.kemet.com:7667/gateway/IntelliData-ComponentDocumentation/1.0/download/datasheet/C0603C220K3RACAUTO>; CAPACITANCE: 0.1µF; DKPN: 720-1688-1-ND; MANUFACTURER: Vishay Vitramon; MOPN: 77-VJ0603Y104JXQPBC; MPN: VJ0603Y104JXQPW1BC; TOLERANCE: 5%; VOLTAGE: 10V
C58 C59 = HyTechDevices:CAPACITOR_?_*: Capacitor, Non-Polarized VJ...1BC Series Datasheet <https://www.mouser.com/datasheet/2/427/vjw1bcbascomseries-1762447.pdf> Samsung Datasheet <https://www.mouser.com/datasheet/2/585/MLCC-1837944.pdf> Samsung Automotive MLCC Datasheet <https://www.mouser.com/datasheet/2/585/MLCC_Automotive-1837966.pdf> Walsin Datasheet <https://www.mouser.com/datasheet/2/210/WTC_MLCC_General_Purpose-1534899.pdf> GRM188R61A226ME15D <https://www.mouser.com/datasheet/2/281/1/GRM188R61A226ME15_02A-1985787.pdf> GRM188R61E106MA73D <https://www.mouser.com/datasheet/2/281/1/GRM188R61E106MA73_01A-1985806.pdf> 885012006013 <https://www.mouser.com/datasheet/2/445/885012006013-1726946.pdf> 2220Y6300105KXTWS2 <https://www.mouser.com/datasheet/2/218/SMD_High_and_Std_StackiCap_P62-1825512.pdf> Yageo Class 2, X5R <https://www.mouser.com/datasheet/2/447/UPY_GPHC_X5R_4V_to_50V_26-1827097.pdf> TDK C Series <https://www.mouser.com/ProductDetail/TDK/C3216X5R1V226M160AC?qs=%2Fha2pyFadujbcx9jh7lYl%2F4NeMoXFhdc8AqVWNq4wW6M2y7zl6GzBuhgtI0ngznN> AVX Automotive MLCC <https://www.mouser.com/datasheet/2/40/AutoMLCC-777028.pdf> KEMET X7R Series <https://www.mouser.com/datasheet/2/212/KEM_C1002_X7R_SMD-1102033.pdf> Kyocera AVX <https://www.mouser.com/datasheet/2/40/C0GNP0_Dielectric-951274.pdf> GRM21BR61H <https://www.mouser.com/datasheet/2/281/1/GRM21BR61H106KE43_01A-1986884.pdf> C1812W104KDRACTU <https://www.mouser.com/datasheet/2/212/KEM_C1034_X7R_HV_ARC_SMD-1101730.pdf> CGA series - MLCC Automotive grade <https://product.tdk.com/system/files/dam/doc/product/capacitor/ceramic/mlcc/catalog/mlcc_automotive_general_en.pdf> TDK C Series Data Sheet <https://product.tdk.com/system/files/dam/doc/product/capacitor/ceramic/mlcc/catalog/mlcc_commercial_general_en.pdf> Kemet Datasheet <https://connect.kemet.com:7667/gateway/IntelliData-ComponentDocumentation/1.0/download/datasheet/C0603C220K3RACAUTO>; CAPACITANCE: 15pF; DKPN: 720-VJ0603A150FXQPW1BCCT-ND; MANUFACTURER: Vishay Vitramon; MOPN: 77-VJ0603A150FXQPBC; MPN: VJ0603A150FXQPW1BC; TOLERANCE: 1%; VOLTAGE: 10V
C60 = HyTechDevices:CAPACITOR_?_*: Capacitor, Non-Polarized VJ...1BC Series Datasheet <https://www.mouser.com/datasheet/2/427/vjw1bcbascomseries-1762447.pdf> Samsung Datasheet <https://www.mouser.com/datasheet/2/585/MLCC-1837944.pdf> Samsung Automotive MLCC Datasheet <https://www.mouser.com/datasheet/2/585/MLCC_Automotive-1837966.pdf> Walsin Datasheet <https://www.mouser.com/datasheet/2/210/WTC_MLCC_General_Purpose-1534899.pdf> GRM188R61A226ME15D <https://www.mouser.com/datasheet/2/281/1/GRM188R61A226ME15_02A-1985787.pdf> GRM188R61E106MA73D <https://www.mouser.com/datasheet/2/281/1/GRM188R61E106MA73_01A-1985806.pdf> 885012006013 <https://www.mouser.com/datasheet/2/445/885012006013-1726946.pdf> 2220Y6300105KXTWS2 <https://www.mouser.com/datasheet/2/218/SMD_High_and_Std_StackiCap_P62-1825512.pdf> Yageo Class 2, X5R <https://www.mouser.com/datasheet/2/447/UPY_GPHC_X5R_4V_to_50V_26-1827097.pdf> TDK C Series <https://www.mouser.com/ProductDetail/TDK/C3216X5R1V226M160AC?qs=%2Fha2pyFadujbcx9jh7lYl%2F4NeMoXFhdc8AqVWNq4wW6M2y7zl6GzBuhgtI0ngznN> AVX Automotive MLCC <https://www.mouser.com/datasheet/2/40/AutoMLCC-777028.pdf> KEMET X7R Series <https://www.mouser.com/datasheet/2/212/KEM_C1002_X7R_SMD-1102033.pdf> Kyocera AVX <https://www.mouser.com/datasheet/2/40/C0GNP0_Dielectric-951274.pdf> GRM21BR61H <https://www.mouser.com/datasheet/2/281/1/GRM21BR61H106KE43_01A-1986884.pdf> C1812W104KDRACTU <https://www.mouser.com/datasheet/2/212/KEM_C1034_X7R_HV_ARC_SMD-1101730.pdf> CGA series - MLCC Automotive grade <https://product.tdk.com/system/files/dam/doc/product/capacitor/ceramic/mlcc/catalog/mlcc_automotive_general_en.pdf> TDK C Series Data Sheet <https://product.tdk.com/system/files/dam/doc/product/capacitor/ceramic/mlcc/catalog/mlcc_commercial_general_en.pdf> Kemet Datasheet <https://connect.kemet.com:7667/gateway/IntelliData-ComponentDocumentation/1.0/download/datasheet/C0603C220K3RACAUTO>; CAPACITANCE: 4.7nF; DKPN: 732-7931-1-ND; MANUFACTURER: Würth Elektronik; MOPN: 710-885012206012; MPN: 885012206012; TOLERANCE: 10%; VOLTAGE: 10V
C61 = HyTechDevices:CAPACITOR_?_*: Capacitor, Non-Polarized VJ...1BC Series Datasheet <https://www.mouser.com/datasheet/2/427/vjw1bcbascomseries-1762447.pdf> Samsung Datasheet <https://www.mouser.com/datasheet/2/585/MLCC-1837944.pdf> Samsung Automotive MLCC Datasheet <https://www.mouser.com/datasheet/2/585/MLCC_Automotive-1837966.pdf> Walsin Datasheet <https://www.mouser.com/datasheet/2/210/WTC_MLCC_General_Purpose-1534899.pdf> GRM188R61A226ME15D <https://www.mouser.com/datasheet/2/281/1/GRM188R61A226ME15_02A-1985787.pdf> GRM188R61E106MA73D <https://www.mouser.com/datasheet/2/281/1/GRM188R61E106MA73_01A-1985806.pdf> 885012006013 <https://www.mouser.com/datasheet/2/445/885012006013-1726946.pdf> 2220Y6300105KXTWS2 <https://www.mouser.com/datasheet/2/218/SMD_High_and_Std_StackiCap_P62-1825512.pdf> Yageo Class 2, X5R <https://www.mouser.com/datasheet/2/447/UPY_GPHC_X5R_4V_to_50V_26-1827097.pdf> TDK C Series <https://www.mouser.com/ProductDetail/TDK/C3216X5R1V226M160AC?qs=%2Fha2pyFadujbcx9jh7lYl%2F4NeMoXFhdc8AqVWNq4wW6M2y7zl6GzBuhgtI0ngznN> AVX Automotive MLCC <https://www.mouser.com/datasheet/2/40/AutoMLCC-777028.pdf> KEMET X7R Series <https://www.mouser.com/datasheet/2/212/KEM_C1002_X7R_SMD-1102033.pdf> Kyocera AVX <https://www.mouser.com/datasheet/2/40/C0GNP0_Dielectric-951274.pdf> GRM21BR61H <https://www.mouser.com/datasheet/2/281/1/GRM21BR61H106KE43_01A-1986884.pdf> C1812W104KDRACTU <https://www.mouser.com/datasheet/2/212/KEM_C1034_X7R_HV_ARC_SMD-1101730.pdf> CGA series - MLCC Automotive grade <https://product.tdk.com/system/files/dam/doc/product/capacitor/ceramic/mlcc/catalog/mlcc_automotive_general_en.pdf> TDK C Series Data Sheet <https://product.tdk.com/system/files/dam/doc/product/capacitor/ceramic/mlcc/catalog/mlcc_commercial_general_en.pdf> Kemet Datasheet <https://connect.kemet.com:7667/gateway/IntelliData-ComponentDocumentation/1.0/download/datasheet/C0603C220K3RACAUTO>; CAPACITANCE: 4.7µF; DKPN: 1276-1044-1-ND; MANUFACTURER: Samsung Electro-Mechanics; MOPN: 187-CL10A475KP8NNNC; MPN: CL10A475KP8NNNC; TOLERANCE: 10%; VOLTAGE: 10V
D1 = HyTechDevices:LED_?_*: LED 0603 Blue <https://www.mouser.com/datasheet/2/216/APT1608VBC_D-246010.pdf> Green <https://www.mouser.com/datasheet/2/216/APT1608ZGCK-1173388.pdf> Orange <https://www.mouser.com/datasheet/2/216/APT1608SECK-6197.pdf> Red <https://www.mouser.com/datasheet/2/216/APT1608SECK-J3-PRV-1173336.pdf> White <https://www.mouser.com/datasheet/2/50/SM0603UWC-880813.pdf> Yellow <https://www.mouser.com/datasheet/2/216/APT1608SYCK-J3-PRV-1173311.pdf> 2835 (Series not on Digikey) Lumiled LUXEON 2835 Color Line <https://www.mouser.com/datasheet/2/602/DS236_luxeon_2835_color_line_datasheet-1596094.pdf>; COLOR: Red; DKPN: 754-1786-1-ND; MANUFACTURER: Kingbright; MOPN: 604-APT1608SECKJ3PRV; MPN: APT1608SECK/J3-PRV
D2 = HyTechDevices:LED_?_*: LED 0603 Blue <https://www.mouser.com/datasheet/2/216/APT1608VBC_D-246010.pdf> Green <https://www.mouser.com/datasheet/2/216/APT1608ZGCK-1173388.pdf> Orange <https://www.mouser.com/datasheet/2/216/APT1608SECK-6197.pdf> Red <https://www.mouser.com/datasheet/2/216/APT1608SECK-J3-PRV-1173336.pdf> White <https://www.mouser.com/datasheet/2/50/SM0603UWC-880813.pdf> Yellow <https://www.mouser.com/datasheet/2/216/APT1608SYCK-J3-PRV-1173311.pdf> 2835 (Series not on Digikey) Lumiled LUXEON 2835 Color Line <https://www.mouser.com/datasheet/2/602/DS236_luxeon_2835_color_line_datasheet-1596094.pdf>; COLOR: Yellow; DKPN: 754-1788-1-ND; MANUFACTURER: Kingbright; MOPN: 604-APT1608SYCK/J3-PRV; MPN: APT1608SYCK/J3-PRV
D3 = HyTechDevices:LED_?_*: LED 0603 Blue <https://www.mouser.com/datasheet/2/216/APT1608VBC_D-246010.pdf> Green <https://www.mouser.com/datasheet/2/216/APT1608ZGCK-1173388.pdf> Orange <https://www.mouser.com/datasheet/2/216/APT1608SECK-6197.pdf> Red <https://www.mouser.com/datasheet/2/216/APT1608SECK-J3-PRV-1173336.pdf> White <https://www.mouser.com/datasheet/2/50/SM0603UWC-880813.pdf> Yellow <https://www.mouser.com/datasheet/2/216/APT1608SYCK-J3-PRV-1173311.pdf> 2835 (Series not on Digikey) Lumiled LUXEON 2835 Color Line <https://www.mouser.com/datasheet/2/602/DS236_luxeon_2835_color_line_datasheet-1596094.pdf>; COLOR: Green; DKPN: 754-1790-1-ND; MANUFACTURER: Kingbright; MOPN: 604-APT1608ZGCK; MPN: APT1608ZGCK
D4 = HyTechDevices:TVS_?_*: TVS Diode GSOT Datasheet <https://www.mouser.com/datasheet/2/427/gsot03-1767593.pdf> SMF14A Datasheet <https://www.vishay.com/docs/85881/smf5v0atosmf58a.pdf>; DKPN: SMF14A-E3-08GITR-ND; MANUFACTURER: Vishay General Semiconductor; MOPN: 78-SMF14A-E3-08; MPN: SMF14A-E3-08; VOLTAGE: 14V
D6 = HyTechDevices:TVS_?_*: TVS Diode GSOT Datasheet <https://www.mouser.com/datasheet/2/427/gsot03-1767593.pdf> SMF14A Datasheet <https://www.vishay.com/docs/85881/smf5v0atosmf58a.pdf>; DKPN: 118-1.5SMBJ30ATR-ND; MANUFACTURER: Bourns Inc.; MOPN: 652-1.5SMBJ30A; MPN: 1.5SMBJ30A; VOLTAGE: 30V
D7 D9 D11 D12 = HyTechDevices:TVS_BIDIRECTIONAL_DUAL: Bdirectional TVS for CAN ESD Datasheet <https://www.ti.com/lit/ds/symlink/tpd2e007.pdf?HQS=dis-mous-null-mousermode-dsf-pf-null-wwe&ts=1615155679700&ref_url=https%253A%252F%252Fwww.mouser.com%252F> SM712 Bidirectional TVS Diode -7V to 12V RSV Used for RS485 transreceiver chips (Works for RS422 since ADM4854ARZ runs both) Datasheet <https://semtech.my.salesforce.com/sfc/p/#E0000000JelG/a/440000001MKW/f6pBKheIN2CeR0DxWdS3THuJ7nh4aKYltSzghsLP5iw>; DKPN: 296-25281-1-ND; MANUFACTURER: Texas Instruments; MOPN: 595-TPD2E007DCKR; MPN: TPD2E007DCKR
D8 D10 = HyTechDevices:TVS_BIDIRECTIONAL_DUAL: Bdirectional TVS for CAN ESD Datasheet <https://www.ti.com/lit/ds/symlink/tpd2e007.pdf?HQS=dis-mous-null-mousermode-dsf-pf-null-wwe&ts=1615155679700&ref_url=https%253A%252F%252Fwww.mouser.com%252F> SM712 Bidirectional TVS Diode -7V to 12V RSV Used for RS485 transreceiver chips (Works for RS422 since ADM4854ARZ runs both) Datasheet <https://semtech.my.salesforce.com/sfc/p/#E0000000JelG/a/440000001MKW/f6pBKheIN2CeR0DxWdS3THuJ7nh4aKYltSzghsLP5iw>; DKPN: SM712CT-ND; MANUFACTURER: Semtech Corporation; MOPN: 947-SM712.TCT; MPN: SM712.TCT
J1 J6 J14 J16 = HyTechDevices:CONNECTOR-8_?_*: 8 Pin Connector; DKPN: WM1798-ND; MANUFACTURER: Molex; MOPN: 538-43045-0814; MPN: 430450814
J2 J3 J7 J13 J15 = HyTechDevices:CONNECTOR-4_?_*: 4 Pin Connector 5051100492 Datasheet <https://www.molex.com/content/dam/molex/molex-dot-com/products/automated/en-us/salesdrawingpdf/505/505110/5051100492_sd.pdf?inline>; DKPN: 2266-43045-0414-ND; MANUFACTURER: Molex; MOPN: 538-43045-0414; MPN: 430450414
J4 J5 J9 = HyTechDevices:CONNECTOR-4_?_*: 4 Pin Connector 5051100492 Datasheet <https://www.molex.com/content/dam/molex/molex-dot-com/products/automated/en-us/salesdrawingpdf/505/505110/5051100492_sd.pdf?inline>; DKPN: WM1832CT-ND; MANUFACTURER: Molex; MOPN: 538-0430450411; MPN: 0430450411
J8 = HyTechDevices:CONNECTOR-2_?_*: 2 Pin Connector; DKPN: WM12762-ND; MANUFACTURER: Molex; MOPN: 538-43650-0217; MPN: 436500217
J10 = HyTechDevices:CONNECTOR-10_?_*: 10 pin connector Datasheet <https://www.mouser.com/datasheet/2/276/0430451014_PCB_HEADERS-143158.pdf>; DKPN: WM1799-ND; MANUFACTURER: MOLEX; MOPN: 538-43045-1014; MPN: 430451014
J11 = HyTechDevices:CONNECTOR-2_?_*: 2 Pin Connector; DKPN: WM14310CT-ND; MANUFACTURER: Molex; MOPN: 538-43650-0214; MPN: 0436500214
J12 = HyTechDevices:CONNECTOR-6_?_*: 6 Pin Connector; DKPN: WM1797-ND; MANUFACTURER: Molex; MOPN: 538-43045-0614; MPN: 430450614
JP4 JP5 JP5V JP6 JP12V JP24V = HyTechDevices:JUMPER_?_*: 2 Pin Connector; DKPN: 13-RC0603FR-130RLTR-ND; MANUFACTURER: YAGEO; MOPN: 603-RC0603FR-130RL; MPN: RC0603FR-130RL
R1 = HyTechDevices:RESISTOR_?_*: Resistor PWR163 Series <https://www.mouser.com/datasheet/2/54/pwr163-777985.pdf> AC Series <https://www.mouser.com/datasheet/2/447/Yageo_PYu_AC_51_RoHS_L_7_1714230-1874691.pdf> PU Series <https://www.mouser.com/datasheet/2/447/PYu-PU_51_RoHS_L_6-1504619.pdf> UCR Series <https://fscdn.rohm.com/en/products/databook/datasheet/passive/resistor/chip_resistor/ucr-e.pdf> ERA Series <https://www.mouser.com/datasheet/2/315/AOA0000C307-1149632.pdf> PWR263 Series <https://www.mouser.com/datasheet/2/54/pwr263s_35-778069.pdf> KTR Series <https://www.mouser.com/datasheet/2/348/ROHM_S_A0011075115_1-2563276.pdf> RC Series <https://www.mouser.com/datasheet/2/447/Yageo_03_18_2021_PYu_RC_Group_51_RoHS_L_11-2199992.pdf> ERJ Low Resistance Series <https://www.mouser.com/datasheet/2/315/AOA0000C313-1141758.pdf> ERJ PB3, PB6 Series <https://www.mouser.com/datasheet/2/315/AOA0000C328-1530132.pdf> ERJ UP3, UP6, UP8 Series <https://www.mouser.com/datasheet/2/315/Panasonic_Resistors_Thick_Film_Anti_Sulf_Anti_Surg-1825099.pdf> ERJ PA2, P03, PA3, P06, P08, P14 Series <https://www.mouser.com/datasheet/2/315/AOA0000C331-1141874.pdf> B20 Series <https://www.ohmite.com/assets/docs/res_200.pdf?r=false> TE Connectivity/Holsworthy RN73 Series <https://www.mouser.com/datasheet/2/418/4/NG_DS_1773270_M-604713.pdf> Vishay Dale D/CRCW e3 <https://www.mouser.com/datasheet/2/427/dcrcwe3-1762152.pdf> Ohmite B20 <https://www.ohmite.com/assets/docs/res_200.pdf?r=false>; DKPN: 1712-CPF-A-0603B1K0ETR-ND; MANUFACTURER: TE Connectivity Passive Product; MOPN: 279-CPF-A-0603B1K0E; MPN: CPF-A-0603B1K0E; POWER: 0.0625W; RESISTANCE: 1k; TOLERANCE: 0.1%; VOLTAGE_CONTINUOUS: 7.9V; VOLTAGE_MAX: 50V
R2 = HyTechDevices:RESISTOR_?_*: Resistor PWR163 Series <https://www.mouser.com/datasheet/2/54/pwr163-777985.pdf> AC Series <https://www.mouser.com/datasheet/2/447/Yageo_PYu_AC_51_RoHS_L_7_1714230-1874691.pdf> PU Series <https://www.mouser.com/datasheet/2/447/PYu-PU_51_RoHS_L_6-1504619.pdf> UCR Series <https://fscdn.rohm.com/en/products/databook/datasheet/passive/resistor/chip_resistor/ucr-e.pdf> ERA Series <https://www.mouser.com/datasheet/2/315/AOA0000C307-1149632.pdf> PWR263 Series <https://www.mouser.com/datasheet/2/54/pwr263s_35-778069.pdf> KTR Series <https://www.mouser.com/datasheet/2/348/ROHM_S_A0011075115_1-2563276.pdf> RC Series <https://www.mouser.com/datasheet/2/447/Yageo_03_18_2021_PYu_RC_Group_51_RoHS_L_11-2199992.pdf> ERJ Low Resistance Series <https://www.mouser.com/datasheet/2/315/AOA0000C313-1141758.pdf> ERJ PB3, PB6 Series <https://www.mouser.com/datasheet/2/315/AOA0000C328-1530132.pdf> ERJ UP3, UP6, UP8 Series <https://www.mouser.com/datasheet/2/315/Panasonic_Resistors_Thick_Film_Anti_Sulf_Anti_Surg-1825099.pdf> ERJ PA2, P03, PA3, P06, P08, P14 Series <https://www.mouser.com/datasheet/2/315/AOA0000C331-1141874.pdf> B20 Series <https://www.ohmite.com/assets/docs/res_200.pdf?r=false> TE Connectivity/Holsworthy RN73 Series <https://www.mouser.com/datasheet/2/418/4/NG_DS_1773270_M-604713.pdf> Vishay Dale D/CRCW e3 <https://www.mouser.com/datasheet/2/427/dcrcwe3-1762152.pdf> Ohmite B20 <https://www.ohmite.com/assets/docs/res_200.pdf?r=false>; DKPN: 311-240HRCT-ND; MANUFACTURER: Yageo; MOPN: 603-RC0603FR-07240RL; MPN: RC0603FR-07240RL; POWER: 0.1W; RESISTANCE: 240; TOLERANCE: 1%; VOLTAGE_CONTINUOUS: 4.90V; VOLTAGE_MAX: 75V
R3 R18-R20 = HyTechDevices:RESISTOR_?_*: Resistor PWR163 Series <https://www.mouser.com/datasheet/2/54/pwr163-777985.pdf> AC Series <https://www.mouser.com/datasheet/2/447/Yageo_PYu_AC_51_RoHS_L_7_1714230-1874691.pdf> PU Series <https://www.mouser.com/datasheet/2/447/PYu-PU_51_RoHS_L_6-1504619.pdf> UCR Series <https://fscdn.rohm.com/en/products/databook/datasheet/passive/resistor/chip_resistor/ucr-e.pdf> ERA Series <https://www.mouser.com/datasheet/2/315/AOA0000C307-1149632.pdf> PWR263 Series <https://www.mouser.com/datasheet/2/54/pwr263s_35-778069.pdf> KTR Series <https://www.mouser.com/datasheet/2/348/ROHM_S_A0011075115_1-2563276.pdf> RC Series <https://www.mouser.com/datasheet/2/447/Yageo_03_18_2021_PYu_RC_Group_51_RoHS_L_11-2199992.pdf> ERJ Low Resistance Series <https://www.mouser.com/datasheet/2/315/AOA0000C313-1141758.pdf> ERJ PB3, PB6 Series <https://www.mouser.com/datasheet/2/315/AOA0000C328-1530132.pdf> ERJ UP3, UP6, UP8 Series <https://www.mouser.com/datasheet/2/315/Panasonic_Resistors_Thick_Film_Anti_Sulf_Anti_Surg-1825099.pdf> ERJ PA2, P03, PA3, P06, P08, P14 Series <https://www.mouser.com/datasheet/2/315/AOA0000C331-1141874.pdf> B20 Series <https://www.ohmite.com/assets/docs/res_200.pdf?r=false> TE Connectivity/Holsworthy RN73 Series <https://www.mouser.com/datasheet/2/418/4/NG_DS_1773270_M-604713.pdf> Vishay Dale D/CRCW e3 <https://www.mouser.com/datasheet/2/427/dcrcwe3-1762152.pdf> Ohmite B20 <https://www.ohmite.com/assets/docs/res_200.pdf?r=false>; DKPN: P120DBCT-ND; MANUFACTURER: Panasonic Electronic Components; MOPN: 667-ERA-3AEB121V; MPN: ERA-3AEB121V; POWER: 0.1W; RESISTANCE: 120; TOLERANCE: 0.1%; VOLTAGE_CONTINUOUS: 3.46V; VOLTAGE_MAX: 75V
R4-R11 = HyTechDevices:RESISTOR_?_*: Resistor PWR163 Series <https://www.mouser.com/datasheet/2/54/pwr163-777985.pdf> AC Series <https://www.mouser.com/datasheet/2/447/Yageo_PYu_AC_51_RoHS_L_7_1714230-1874691.pdf> PU Series <https://www.mouser.com/datasheet/2/447/PYu-PU_51_RoHS_L_6-1504619.pdf> UCR Series <https://fscdn.rohm.com/en/products/databook/datasheet/passive/resistor/chip_resistor/ucr-e.pdf> ERA Series <https://www.mouser.com/datasheet/2/315/AOA0000C307-1149632.pdf> PWR263 Series <https://www.mouser.com/datasheet/2/54/pwr263s_35-778069.pdf> KTR Series <https://www.mouser.com/datasheet/2/348/ROHM_S_A0011075115_1-2563276.pdf> RC Series <https://www.mouser.com/datasheet/2/447/Yageo_03_18_2021_PYu_RC_Group_51_RoHS_L_11-2199992.pdf> ERJ Low Resistance Series <https://www.mouser.com/datasheet/2/315/AOA0000C313-1141758.pdf> ERJ PB3, PB6 Series <https://www.mouser.com/datasheet/2/315/AOA0000C328-1530132.pdf> ERJ UP3, UP6, UP8 Series <https://www.mouser.com/datasheet/2/315/Panasonic_Resistors_Thick_Film_Anti_Sulf_Anti_Surg-1825099.pdf> ERJ PA2, P03, PA3, P06, P08, P14 Series <https://www.mouser.com/datasheet/2/315/AOA0000C331-1141874.pdf> B20 Series <https://www.ohmite.com/assets/docs/res_200.pdf?r=false> TE Connectivity/Holsworthy RN73 Series <https://www.mouser.com/datasheet/2/418/4/NG_DS_1773270_M-604713.pdf> Vishay Dale D/CRCW e3 <https://www.mouser.com/datasheet/2/427/dcrcwe3-1762152.pdf> Ohmite B20 <https://www.ohmite.com/assets/docs/res_200.pdf?r=false>; DKPN: 764-1461-2-ND; MANUFACTURER: Vishay Dale Thin Film; MOPN: 71-PTN0603E8351BST1; MPN: PTN0603E8351BST1; POWER: 0.15W; RESISTANCE: 8.35k; TOLERANCE: 0.1%; VOLTAGE_CONTINUOUS: 28.90V; VOLTAGE_MAX: 75V
R12 R13 = HyTechDevices:RESISTOR_?_*: Resistor PWR163 Series <https://www.mouser.com/datasheet/2/54/pwr163-777985.pdf> AC Series <https://www.mouser.com/datasheet/2/447/Yageo_PYu_AC_51_RoHS_L_7_1714230-1874691.pdf> PU Series <https://www.mouser.com/datasheet/2/447/PYu-PU_51_RoHS_L_6-1504619.pdf> UCR Series <https://fscdn.rohm.com/en/products/databook/datasheet/passive/resistor/chip_resistor/ucr-e.pdf> ERA Series <https://www.mouser.com/datasheet/2/315/AOA0000C307-1149632.pdf> PWR263 Series <https://www.mouser.com/datasheet/2/54/pwr263s_35-778069.pdf> KTR Series <https://www.mouser.com/datasheet/2/348/ROHM_S_A0011075115_1-2563276.pdf> RC Series <https://www.mouser.com/datasheet/2/447/Yageo_03_18_2021_PYu_RC_Group_51_RoHS_L_11-2199992.pdf> ERJ Low Resistance Series <https://www.mouser.com/datasheet/2/315/AOA0000C313-1141758.pdf> ERJ PB3, PB6 Series <https://www.mouser.com/datasheet/2/315/AOA0000C328-1530132.pdf> ERJ UP3, UP6, UP8 Series <https://www.mouser.com/datasheet/2/315/Panasonic_Resistors_Thick_Film_Anti_Sulf_Anti_Surg-1825099.pdf> ERJ PA2, P03, PA3, P06, P08, P14 Series <https://www.mouser.com/datasheet/2/315/AOA0000C331-1141874.pdf> B20 Series <https://www.ohmite.com/assets/docs/res_200.pdf?r=false> TE Connectivity/Holsworthy RN73 Series <https://www.mouser.com/datasheet/2/418/4/NG_DS_1773270_M-604713.pdf> Vishay Dale D/CRCW e3 <https://www.mouser.com/datasheet/2/427/dcrcwe3-1762152.pdf> Ohmite B20 <https://www.ohmite.com/assets/docs/res_200.pdf?r=false>; DKPN: 10-ERJ-UP3F2001VTR-ND; MANUFACTURER: Panasonic Electronic Components; MOPN: 667-ERJ-UP3F2001V; MPN: ERJ-UP3F2001V; POWER: 0.25W; RESISTANCE: 2k; TOLERANCE: 1%; VOLTAGE_CONTINUOUS: 22.36V; VOLTAGE_MAX: 150V
R14 R16 = HyTechDevices:RESISTOR_?_*: Resistor PWR163 Series <https://www.mouser.com/datasheet/2/54/pwr163-777985.pdf> AC Series <https://www.mouser.com/datasheet/2/447/Yageo_PYu_AC_51_RoHS_L_7_1714230-1874691.pdf> PU Series <https://www.mouser.com/datasheet/2/447/PYu-PU_51_RoHS_L_6-1504619.pdf> UCR Series <https://fscdn.rohm.com/en/products/databook/datasheet/passive/resistor/chip_resistor/ucr-e.pdf> ERA Series <https://www.mouser.com/datasheet/2/315/AOA0000C307-1149632.pdf> PWR263 Series <https://www.mouser.com/datasheet/2/54/pwr263s_35-778069.pdf> KTR Series <https://www.mouser.com/datasheet/2/348/ROHM_S_A0011075115_1-2563276.pdf> RC Series <https://www.mouser.com/datasheet/2/447/Yageo_03_18_2021_PYu_RC_Group_51_RoHS_L_11-2199992.pdf> ERJ Low Resistance Series <https://www.mouser.com/datasheet/2/315/AOA0000C313-1141758.pdf> ERJ PB3, PB6 Series <https://www.mouser.com/datasheet/2/315/AOA0000C328-1530132.pdf> ERJ UP3, UP6, UP8 Series <https://www.mouser.com/datasheet/2/315/Panasonic_Resistors_Thick_Film_Anti_Sulf_Anti_Surg-1825099.pdf> ERJ PA2, P03, PA3, P06, P08, P14 Series <https://www.mouser.com/datasheet/2/315/AOA0000C331-1141874.pdf> B20 Series <https://www.ohmite.com/assets/docs/res_200.pdf?r=false> TE Connectivity/Holsworthy RN73 Series <https://www.mouser.com/datasheet/2/418/4/NG_DS_1773270_M-604713.pdf> Vishay Dale D/CRCW e3 <https://www.mouser.com/datasheet/2/427/dcrcwe3-1762152.pdf> Ohmite B20 <https://www.ohmite.com/assets/docs/res_200.pdf?r=false>; DKPN: P1.33KDBCT-ND; MANUFACTURER: Panasonic Electronic Components; MOPN: 667-ERA-3AEB1331V; MPN: ERA-3AEB1331V; POWER: 0.1W; RESISTANCE: 1.33k; TOLERANCE: 0.1%; VOLTAGE_CONTINUOUS: 11.53V; VOLTAGE_MAX: 75V
R15 R17 = HyTechDevices:RESISTOR_?_*: Resistor PWR163 Series <https://www.mouser.com/datasheet/2/54/pwr163-777985.pdf> AC Series <https://www.mouser.com/datasheet/2/447/Yageo_PYu_AC_51_RoHS_L_7_1714230-1874691.pdf> PU Series <https://www.mouser.com/datasheet/2/447/PYu-PU_51_RoHS_L_6-1504619.pdf> UCR Series <https://fscdn.rohm.com/en/products/databook/datasheet/passive/resistor/chip_resistor/ucr-e.pdf> ERA Series <https://www.mouser.com/datasheet/2/315/AOA0000C307-1149632.pdf> PWR263 Series <https://www.mouser.com/datasheet/2/54/pwr263s_35-778069.pdf> KTR Series <https://www.mouser.com/datasheet/2/348/ROHM_S_A0011075115_1-2563276.pdf> RC Series <https://www.mouser.com/datasheet/2/447/Yageo_03_18_2021_PYu_RC_Group_51_RoHS_L_11-2199992.pdf> ERJ Low Resistance Series <https://www.mouser.com/datasheet/2/315/AOA0000C313-1141758.pdf> ERJ PB3, PB6 Series <https://www.mouser.com/datasheet/2/315/AOA0000C328-1530132.pdf> ERJ UP3, UP6, UP8 Series <https://www.mouser.com/datasheet/2/315/Panasonic_Resistors_Thick_Film_Anti_Sulf_Anti_Surg-1825099.pdf> ERJ PA2, P03, PA3, P06, P08, P14 Series <https://www.mouser.com/datasheet/2/315/AOA0000C331-1141874.pdf> B20 Series <https://www.ohmite.com/assets/docs/res_200.pdf?r=false> TE Connectivity/Holsworthy RN73 Series <https://www.mouser.com/datasheet/2/418/4/NG_DS_1773270_M-604713.pdf> Vishay Dale D/CRCW e3 <https://www.mouser.com/datasheet/2/427/dcrcwe3-1762152.pdf> Ohmite B20 <https://www.ohmite.com/assets/docs/res_200.pdf?r=false>; DKPN: P1.13KHCT-ND; MANUFACTURER: Panasonic Electronic Components; MOPN: 667-ERJ-3EKF1131V; MPN: ERJ-3EKF1131V; POWER: 0.1W; RESISTANCE: 1.13k; TOLERANCE: 1%; VOLTAGE_CONTINUOUS: 75V; VOLTAGE_MAX: 150V
R21 R22 = HyTechDevices:RESISTOR_?_*: Resistor PWR163 Series <https://www.mouser.com/datasheet/2/54/pwr163-777985.pdf> AC Series <https://www.mouser.com/datasheet/2/447/Yageo_PYu_AC_51_RoHS_L_7_1714230-1874691.pdf> PU Series <https://www.mouser.com/datasheet/2/447/PYu-PU_51_RoHS_L_6-1504619.pdf> UCR Series <https://fscdn.rohm.com/en/products/databook/datasheet/passive/resistor/chip_resistor/ucr-e.pdf> ERA Series <https://www.mouser.com/datasheet/2/315/AOA0000C307-1149632.pdf> PWR263 Series <https://www.mouser.com/datasheet/2/54/pwr263s_35-778069.pdf> KTR Series <https://www.mouser.com/datasheet/2/348/ROHM_S_A0011075115_1-2563276.pdf> RC Series <https://www.mouser.com/datasheet/2/447/Yageo_03_18_2021_PYu_RC_Group_51_RoHS_L_11-2199992.pdf> ERJ Low Resistance Series <https://www.mouser.com/datasheet/2/315/AOA0000C313-1141758.pdf> ERJ PB3, PB6 Series <https://www.mouser.com/datasheet/2/315/AOA0000C328-1530132.pdf> ERJ UP3, UP6, UP8 Series <https://www.mouser.com/datasheet/2/315/Panasonic_Resistors_Thick_Film_Anti_Sulf_Anti_Surg-1825099.pdf> ERJ PA2, P03, PA3, P06, P08, P14 Series <https://www.mouser.com/datasheet/2/315/AOA0000C331-1141874.pdf> B20 Series <https://www.ohmite.com/assets/docs/res_200.pdf?r=false> TE Connectivity/Holsworthy RN73 Series <https://www.mouser.com/datasheet/2/418/4/NG_DS_1773270_M-604713.pdf> Vishay Dale D/CRCW e3 <https://www.mouser.com/datasheet/2/427/dcrcwe3-1762152.pdf> Ohmite B20 <https://www.ohmite.com/assets/docs/res_200.pdf?r=false>; DKPN: 311-60.4HRCT-ND; MANUFACTURER: Yageo; MOPN: 603-RC0603FR-0760R4L; MPN: RC0603FR-0760R4L; POWER: 0.1W; RESISTANCE: 60.4; TOLERANCE: 1%; VOLTAGE_CONTINUOUS: 2.48V; VOLTAGE_MAX: 75V
T1 T2 = HyTechDevices:78613/3C: Murata 78613/3C Pulse Transformers 1CT:1 200 UH Datasheet <https://www.murata.com/products/productdata/8816046047262/kmp-786.pdf>; DKPN: 811-3726-ND; MANUFACTURER: Murata Power Solutions; MOPN: 580-786133C; MPN: 78613/3C
U1 = HyTechDevices:VOLTAGE_REGULATOR_?_*: Voltage Regulators LDL1117S50R Datasheet <https://www.mouser.com/datasheet/2/389/dm00366442-1799212.pdf> NCP785AH120T1G <https://www.mouser.com/datasheet/2/308/NCP785A_D-1812704.pdf> LMS8117A Datasheet <https://www.ti.com/lit/ds/symlink/lms8117a.pdf?HQS> ST732M50R Datasheet <https://www.mouser.com/datasheet/2/389/st732-1830546.pdf> LM2937IMPX-10/NOPB Datasheet <https://www.ti.com/lit/ds/symlink/lm2937.pdf> L78L15ACUTR Datasheet <https://www.mouser.com/datasheet/2/389/l78l-1849295.pdf>; DKPN: LMS8117AMP-3.3/NOPBCT-ND; MANUFACTURER: Texas Instruments; MOPN: 926-LMS8117AMP33NOPB; MPN: LMS8117AMP-3.3/NOPB
U10 = HyTechDevices:MAX3227: Analog Device MAX3227 Datasheet <https://www.analog.com/media/en/technical-documentation/data-sheets/max3224e-max3245e.pdf> 3-V to 5.5-V Single-Channel RS232 Driver/Receiver; DKPN: 175-MAX3227EEAE/V+TCT-ND; MANUFACTURER: Analog Devices Inc.; MOPN: 700-MAX3227EAE; MPN: MAX3227EEAE/V+T
U11 U12 = HyTechDevices:LTC6820: LTC6820 isoSPI Isolated Communications Interface Datasheet <mouser.com/datasheet/2/609/LTC6820-1601976.pdf>; MANUFACTURER: Analog Devices; MPN: LTC6820IMS#PBF
U13 = HyTechDevices:TCAN1051*V-Q1: TCAN1051*V Can Tranciever Datasheet <https://www.ti.com/lit/ds/symlink/tcan1051hgv-q1.pdf?HQS=dis-mous-null-mousermode-dsf-pf-null-wwe&ts=1610765132518&ref_url=https%253A%252F%252Fwww.mouser.com%252Ff>; DKPN: 296-49935-1-ND; MANUFACTURER: Texas Instruments; MOPN: 595-TCAN1051HGVDQ1; MPN: TCAN1051HGVDRQ1
U14 = HyTechDevices:MAX3075: 3.3 V RS-485/RS-422 Transceivers Datasheet <https://www.analog.com/media/en/technical-documentation/data-sheets/max3070e-max3079e.pdf>; DKPN: MAX3075EESA+-ND; MANUFACTURER: Analog Devices Inc.; MOPN: 700-MAX3075EESA; MPN: MAX3075EESA+
U15 = HyTechDevices:MCP3208: Microchip MCP3208 ADC 8-channel 12-bit SPI Datasheet <https://www.mouser.com/datasheet/2/268/21298e-1101808.pdf>; DKPN: MCP3208T-BI/SLCT-ND; MANUFACTURER: Microchip Technology; MOPN: 579-MCP3208T-BI/SL; MPN: MCP3208T-BI/SL
XF1 = HyTechDevices:FUSE_HOLDER_*: Fuse Holder All PNs for the holder; if Miniblade Fuses <https://www.littelfuse.com/media?resourcetype=datasheets&itemid=0f5f58cb-559e-494b-8d53-723f30445ae5&filename=littelfuse-mini-datasheet> needed, order separately. Mini-Blade PTH <https://www.mouser.com/datasheet/2/215/3568-742601.pdf> Mini-Blade SMD <https://www.mouser.com/datasheet/2/215/588-744913.pdf> Littelfuse 122 Fuse Holder and Fuse Fuse <https://www.littelfuse.com/~/media/electronics/datasheets/fuses/littelfuse_fuse_508_datasheet.pdf.pdf> Fuse Holder <https://www.littelfuse.com/~/media/electronics/datasheets/fuse_clips/littelfuse_fuse_clip_102_122_datasheet.pdf.pdf>; DKPN: 36-3588-ND; FUSE_TYPE: MINI 297; MANUFACTURER: Keystone Electronics; MOPN: 534-3588; MPN: 3588